# EAGLE design SparkFun_MicroMod_Function_SARA-R5 (EAGLE 9.6.2)
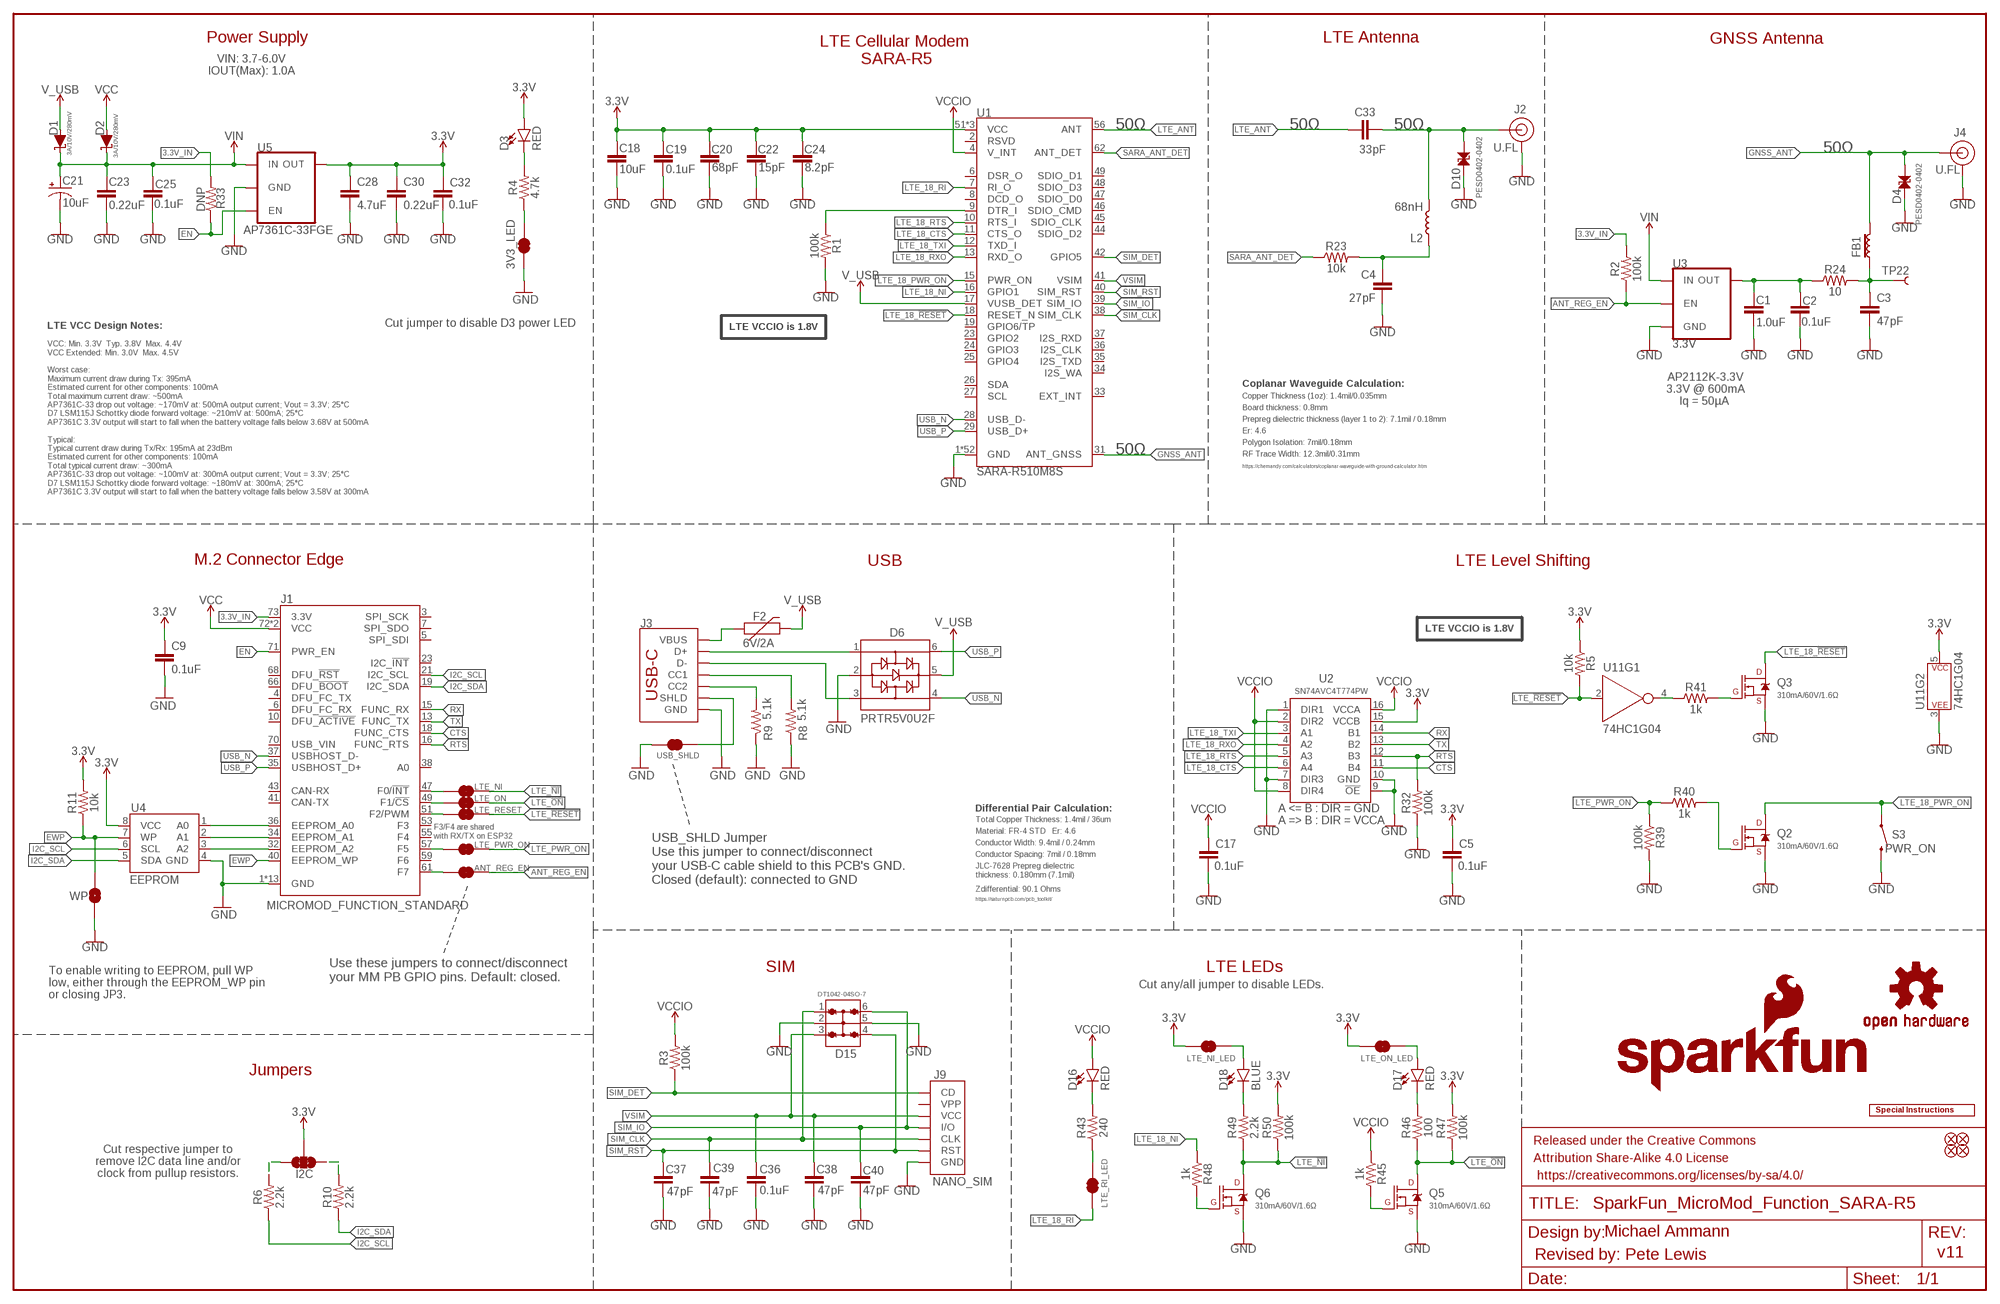
[diagram p0: schematic, sheet 1]

## Parts
3V3_LED  JUMPER-SMT_2_NC_TRACE_SILK  [SMT-JUMPER_2_NC_TRACE_SILK]
ANT_REG_EN  JUMPER-SMT_2_NC_TRACE_SILK  [SMT-JUMPER_2_NC_TRACE_SILK]
C1  1.0uF  1.0UF-0603-16V-10%  [0603]
C2  0.1uF  0.1UF-0402T-16V-10%  [0402-TIGHT]
C3  47pF  47PF-0603-50V-5%  [0603]
C4  27pF  27PF-0402-50V-5%  [0402]
C5  0.1uF  0.1UF-0402T-16V-10%  [0402-TIGHT]
C9  0.1uF  0.1UF-0402T-16V-10%  [0402-TIGHT]
C17  0.1uF  0.1UF-0402T-16V-10%  [0402-TIGHT]
C18  10uF  10UF-0603-6.3V-20%  [0603]
C19  0.1uF  0.1UF-0402T-16V-10%  [0402-TIGHT]
C20  68pF  68PF-0603-50V-5%  [0603]
C21  10uF  10UF-POLAR-EIA3216-16V-10%(TANT)  [EIA3216]
C22  15pF  15PF-0603-50V-5%  [0603]
C23  0.22uF  0.22UF-0603-25V-10%  [0603]
C24  8.2pF  8.2PF-0603-50V-10%  [0603]
C25  0.1uF  0.1UF-0402T-16V-10%  [0402-TIGHT]
C28  4.7uF  4.7UF-0603-6.3V-(10%)  [0603]
C30  0.22uF  0.22UF-0603-25V-10%  [0603]
C32  0.1uF  0.1UF-0402T-16V-10%  [0402-TIGHT]
C33  33pF  33PF-0402T-50V-5%  [0402-TIGHT]
C36  0.1uF  0.1UF-0402T-16V-10%  [0402-TIGHT]
C37  47pF  47PF-0603-50V-5%  [0603]
C38  47pF  47PF-0603-50V-5%  [0603]
C39  47pF  47PF-0603-50V-5%  [0603]
C40  47pF  47PF-0603-50V-5%  [0603]
D1  3A/10V/280mV  DIODE-SCHOTTKY-BAT60A  [SOD-323]
D2  3A/10V/280mV  DIODE-SCHOTTKY-BAT60A  [SOD-323]
D3  RED  LED-RED_0603-KB  [LED-0603]
D4  PESD0402-0402  [0402]
D6  PRTR5V0U2F  [SOT886]
D10  PESD0402-0402  [0402]
D15  DT1042-04SO-7  TVS_DIODE_ARRAY_4_ESDA6V1BC6  [SOT23-6L]
D16  RED  LED-RED_0603-KB  [LED-0603]
D17  RED  LED-RED_0603-KB  [LED-0603]
D18  BLUE  LED-BLUE0603  [LED-0603]
F2  6V/2A  PPTC_6V2A  [1210]
FB1  30Ω/1.8A  FERRITE_BEAD-0603  [0603]
FD1  FIDUCIALUFIDUCIAL  [FIDUCIAL-MICRO]
FD2  FIDUCIALUFIDUCIAL  [FIDUCIAL-MICRO]
FD3  FIDUCIALUFIDUCIAL  [FIDUCIAL-MICRO]
FD4  FIDUCIALUFIDUCIAL  [FIDUCIAL-MICRO]
FRAME2  FRAME-LEDGER  [CREATIVE_COMMONS]
I2C  JUMPER-SMT_3_2-NC_TRACE_SILK  [SMT-JUMPER_3_2-NC_TRACE_SILK]
J1  MICROMOD_FUNCTION_STANDARD  [M.2-CARD-E-22_FUNCTION_STANDARD]
J2  U.FL  U.FL2PIN  [U.FL]
J3  USB_C_2-LAYER_PADS  [USB-C-16P-2LAYER-PADS]
J4  U.FL  U.FL2PIN  [U.FL]
J9  NANO_SIM  SIMHOLDER_WITH_CD-PUSHPUSH  [NANO_SIM_PP]
L2  68nH  68NH-0402-200MA  [0402_COILCRAFT]
LOGO1  SFE_LOGO_NAME_FLAME.2_INCH  [SFE_LOGO_NAME_FLAME_.2]
LOGO2  SFE_LOGO_FLAME.2_INCH  [SFE_LOGO_FLAME_.2]
LOGO3  SPECIAL_INSTRUCTIONS-ORDERING  [ORDERING_INSTRUCTIONS]
LOGO4  OSHW-LOGOMINI  [OSHW-LOGO-MINI]
LTE_NI  JUMPER-SMT_2_NC_TRACE_SILK  [SMT-JUMPER_2_NC_TRACE_SILK]
LTE_NI_LED  JUMPER-SMT_2_NC_TRACE_SILK  [SMT-JUMPER_2_NC_TRACE_SILK]
LTE_ON  JUMPER-SMT_2_NC_TRACE_SILK  [SMT-JUMPER_2_NC_TRACE_SILK]
LTE_ON_LED  JUMPER-SMT_2_NC_TRACE_SILK  [SMT-JUMPER_2_NC_TRACE_SILK]
LTE_PWR_ON  JUMPER-SMT_2_NC_TRACE_SILK  [SMT-JUMPER_2_NC_TRACE_SILK]
LTE_RESET  JUMPER-SMT_2_NC_TRACE_SILK  [SMT-JUMPER_2_NC_TRACE_SILK]
LTE_RI_LED  JUMPER-SMT_2_NC_TRACE_SILK  [SMT-JUMPER_2_NC_TRACE_SILK]
Q2  310mA/60V/1.6Ω  MOSFET-NCH-2N7002PW  [SOT323]
Q3  310mA/60V/1.6Ω  MOSFET-NCH-2N7002PW  [SOT323]
Q5  310mA/60V/1.6Ω  MOSFET-NCH-2N7002PW  [SOT323]
Q6  310mA/60V/1.6Ω  MOSFET-NCH-2N7002PW  [SOT323]
R1  100k  100KOHM-0402T-1/16W-1%  [0402-TIGHT]
R2  100k  100KOHM-0402T-1/16W-1%  [0402-TIGHT]
R3  100k  100KOHM-0402T-1/16W-1%  [0402-TIGHT]
R4  4.7k  4.7KOHM-0402T-1/16W-1%  [0402-TIGHT]
R5  10k  10KOHM-0402T-1/16W-1%  [0402-TIGHT]
R6  2.2k  2.2KOHM-0402T-1/16W-1%  [0402-TIGHT]
R8  5.1k  5.1KOHM-0402T-1/16W-1%  [0402-TIGHT]
R9  5.1k  5.1KOHM-0402T-1/16W-1%  [0402-TIGHT]
R10  2.2k  2.2KOHM-0402T-1/16W-1%  [0402-TIGHT]
R11  10k  10KOHM-0402T-1/16W-1%  [0402-TIGHT]
R23  10k  10KOHM-0402T-1/16W-1%  [0402-TIGHT]
R24  10  10OHM-0603-1/10W-1%  [0603]
R32  100k  100KOHM-0402T-1/16W-1%  [0402-TIGHT]
R33  DNP  100KOHM-0402T-1/16W-1%  [0402-TIGHT]
R39  100k  100KOHM-0402T-1/16W-1%  [0402-TIGHT]
R40  1k  1KOHM-0402T-1/16W-1%  [0402-TIGHT]
R41  1k  1KOHM-0402T-1/16W-1%  [0402-TIGHT]
R43  240  240OHM-0603-1/10W-1%  [0603]
R45  1k  1KOHM-0402T-1/16W-1%  [0402-TIGHT]
R46  100  100OHM-0603-1/10W-1%  [0603]
R47  100k  100KOHM-0402T-1/16W-1%  [0402-TIGHT]
R48  1k  1KOHM-0402T-1/16W-1%  [0402-TIGHT]
R49  2.2k  2.2KOHM-0402T-1/16W-1%  [0402-TIGHT]
R50  100k  100KOHM-0402T-1/16W-1%  [0402-TIGHT]
S3  PWR_ON  MOMENTARY-SWITCH-SPST-SMD-4.6X2.8MM  [TACTILE_SWITCH_SMD_4.6X2.8MM]
TP22  TEST-POINT3X4  [PAD.03X.04]
U1  SARA-R510M8S  [SARA-LGA]
U2  SN74AVC4T774PW  [SOP65P640X120-16N]
U3  3.3V  V_REG_AP2112K-3.3V  [SOT23-5]
U4  EEPROM  EEPROM-I2C512K  [SO08]
U5  AP7361C-33FGE  AP7361C-33FGEUDFN-8  [UDFN-8]
U11  74HC1G04  [SOT353]
USB_SHLD  JUMPER-SMT_2_NC_TRACE_SILK  [SMT-JUMPER_2_NC_TRACE_SILK]
WP  JUMPER-SMT_2_NO_SILK  [SMT-JUMPER_2_NO_SILK]

## Nets
3.3V: C5.1 C9.1 C18.1 C19.1 C20.1 C22.1 C24.1 C28.1 C30.1 C32.1 D3.A I2C.2 LTE_NI_LED.2 LTE_ON_LED.2 R5.1 R11.2 R47.2 R50.2 U1.51(VCC) U1.52(VCC) U1.53(VCC) U2.15(VCCB) U4.8(VCC) U5.1(OUT) U11.5(P$V+)
3.3V_IN: J1.73(3.3V) R2.2 R33.2
ANT_REG_EN: ANT_REG_EN.1 R2.1 U3.3(EN)
CTS: J1.18(FUNC_CTS) U2.11(B4)
EN: J1.71(PWR_EN) R33.1 U5.5(EN)
EWP: J1.40(EEPROM_WP) R11.1 U4.7(WP) WP.2
GND: 3V3_LED.1 C1.2 C2.2 C3.2 C4.2 C5.2 C9.2 C17.2 C18.2 C19.2 C20.2 C21.- C22.2 C23.2 C24.2 C25.2 C28.2 C30.2 C32.2 C36.1 C37.2 C38.1 C39.2 C40.1 D4.2 D6.2 D10.2 D15.2 D15.5 J1.1(GND) J1.2(GND) J1.8(GND) J1.33(GND) J1.39(GND) J1.45(GND) J1.75(GND) J1.GND1(GND) J1.GND2(GND) J1.GND3(GND) J1.GND4(GND) J1.GND5(GND) J1.GND6(GND) J2.1(GND) J2.2(GND) J3.GND J3.GND2(GND) J4.1(GND) J4.2(GND) J9.A1(GND) J9.A2(GND) J9.A3(GND) J9.A4(GND) J9.C5(GND) Q2.2(S) Q3.2(S) Q5.2(S) Q6.2(S) R1.2 R8.1 R9.1 R32.1 R39.2 S3.3 S3.4 U1.1(GND) U1.3(GND) U1.5(GND) U1.14(GND) U1.20(GND) U1.21(GND) U1.22(GND) U1.30(GND) U1.32(GND) U1.43(GND) U1.50(GND) U1.54(GND) U1.55(GND) U1.57(GND) U1.58(GND) U1.59(GND) U1.60(GND) U1.61(GND) U1.63(GND) U1.64(GND) U1.65(GND) U1.66(GND) U1.67(GND) U1.68(GND) U1.69(GND) U1.70(GND) U1.71(GND) U1.72(GND) U1.73(GND) U1.74(GND) U1.75(GND) U1.76(GND) U1.77(GND) U1.78(GND) U1.79(GND) U1.80(GND) U1.81(GND) U1.82(GND) U1.83(GND) U1.84(GND) U1.85(GND) U1.86(GND) U1.87(GND) U1.88(GND) U1.89(GND) U1.90(GND) U1.91(GND) U1.92(GND) U1.93(GND) U1.94(GND) U1.95(GND) U1.96(GND) U2.1(DIR1) U2.7(DIR3) U2.9(!OE) U2.10(GND) U3.2(GND) U4.4(GND) U5.4(GND) U5.EP(GND) U11.3(P$V-) USB_SHLD.2 WP.1
GNSS_ANT [RF]: D4.1 FB1.2 J4.FEED(SIGNAL) U1.31(ANT_GNSS)
I2C_SCL: J1.21(I2C_SCL) R6.1 U4.6(SCL)
I2C_SDA: J1.19(I2C_SDA) R10.1 U4.5(SDA)
LTE_18_!RESET!: Q3.3(D) U1.18(RESET_N)
LTE_18_CTS: U1.11(CTS_O) U2.6(A4)
LTE_18_DTR: R1.1 U1.9(DTR_I)
LTE_18_NI: R48.1 U1.16(GPIO1)
LTE_18_PWR_ON: Q2.3(D) S3.1 S3.2 U1.15(PWR_ON)
LTE_18_RI: LTE_RI_LED.2 U1.7(RI_O)
LTE_18_RTS: U1.10(RTS_I) U2.5(A3)
LTE_18_RXO: U1.13(RXD_O) U2.4(A2)
LTE_18_TXI: U1.12(TXD_I) U2.3(A1)
LTE_!NI!: LTE_NI.1 Q6.3(D) R49.1 R50.1
LTE_!ON!: LTE_ON.1 Q5.3(D) R46.1 R47.1
LTE_!RESET!: LTE_RESET.1 R5.2 U11.2(A)
LTE_ANT [RF]: C33.1 U1.56(ANT)
LTE_PWR_ON: LTE_PWR_ON.1 R39.1 R40.1
N$1: J1.36(EEPROM_A0) U4.1(A0)
N$2: J3.A5(CC1) R8.2
N$3: J1.57(F5) LTE_PWR_ON.2
N$4: ANT_REG_EN.2 J1.61(F7)
N$5: J3.B5(CC2) R9.2
N$6: 3V3_LED.2 R4.1
N$7: D3.C R4.2
N$8: J1.32(EEPROM_A2) U4.3(A2)
N$9: J1.34(EEPROM_A1) U4.2(A1)
N$10: D6.1 J3.A6(D+) J3.B6(D+)
N$11 [RF]: C33.2 D10.1 J2.FEED(SIGNAL) L2.P$2
N$12: J1.47(F0/!INT!) LTE_NI.2
N$13: I2C.1 R10.2
N$14: I2C.3 R6.2
N$15 [DiffPair]: D6.3 J3.A7(D-) J3.B7(D-)
N$16: J1.49(F1/!CS!) LTE_ON.2
N$17: J1.51(F2/PWM) LTE_RESET.2
N$18: C4.1 L2.P$1 R23.2
N$19: D18.A LTE_NI_LED.1
N$20: LTE_RI_LED.1 R43.1
N$21: D17.A LTE_ON_LED.1
N$22: F2.1 J3.VBUS1(VBUS) J3.VBUS2(VBUS)
N$24: C1.1 C2.1 R24.1 U3.5(OUT)
N$25: C3.1 FB1.1 R24.2 TP22.1
N$26: Q2.1(G) R40.2
N$27: Q3.1(G) R41.2
N$28: R41.1 U11.4(Y)
N$34: D16.C R43.2
N$35: Q6.1(G) R48.2
N$37: D18.C R49.2
N$47: Q5.1(G) R45.2
N$49: D17.C R46.2
RTS: J1.16(FUNC_RTS) R32.2 U2.12(B3)
RX: J1.15(FUNC_RX) U2.14(B1)
SARA_ANT_DET: R23.1 U1.62(ANT_DET)
SHLD: J3.SHLD1(SHLD) J3.SHLD2(SHLD) J3.SHLD3(SHLD) J3.SHLD4(SHLD) USB_SHLD.1
SIM_CLK: C39.1 D15.1 J9.C3(CLK) U1.38(SIM_CLK)
SIM_DET: J9.CD R3.1 U1.42(GPIO5)
SIM_IO: C40.2 D15.6 J9.C7(I/O) U1.39(SIM_IO)
SIM_RST: C37.1 D15.4 J9.C2(RST) U1.40(SIM_RST)
TX: J1.13(FUNC_TX) U2.13(B2)
USB_N [DiffPair]: D6.4 J1.37(USBHOST_D-) U1.28(USB_D-)
USB_P [DiffPair]: D6.6 J1.35(USBHOST_D+) U1.29(USB_D+)
V_USB: D1.A D6.5 F2.2 U1.17(VUSB_DET)
VCC: D2.A J1.72(VCC) J1.74(VCC)
VCCIO [supply]: C17.1 D16.A R3.2 R45.1 U1.4(V_INT) U2.2(DIR2) U2.8(DIR4) U2.16(VCCA)
VIN: C21.+ C23.1 C25.1 D1.C D2.C U3.1(IN) U5.8(IN)
VSIM [supply]: C36.2 C38.2 D15.3 J9.C1(VCC) U1.41(VSIM)
Unconnected: J1.3(SPI_SCK) J1.4(DFU_FC_TX) J1.5(SPI_SDI) J1.6(DFU_FC_RX) J1.7(SPI_SDO) J1.10(DFU_!ACTIVE!) J1.23(I2C_!INT!) J1.38(A0) J1.41(CAN-TX) J1.43(CAN-RX) J1.53(F3) J1.55(F4) J1.59(F6) J1.66(DFU_!BOOT!) J1.68(DFU_!RST!) J1.70(USB_VIN) J9.C6(VPP) U1.2(RSVD) U1.6(DSR_O) U1.8(DCD_O) U1.19(GPIO6/TP) U1.23(GPIO2) U1.24(GPIO3) U1.25(GPIO4) U1.26(SDA) U1.27(SCL) U1.33(EXT_INT) U1.34(I2S_WA) U1.35(I2S_TXD) U1.36(I2S_CLK) U1.37(I2S_RXD) U1.44(SDIO_D2) U1.45(SDIO_CLK) U1.46(SDIO_CMD) U1.47(SDIO_D0) U1.48(SDIO_D3) U1.49(SDIO_D1)

## Notes on the sheet
- Power Supply | LTE Antenna | GNSS Antenna
- LTE Cellular Modem 
  SARA-R5
- VIN: 3.7-6.0V
  IOUT(Max): 1.0A
- 50Ω | 50Ω | 50Ω
- 50Ω
- LTE VCCIO is 1.8V
- LTE VCC Design Notes: | Cut jumper to disable D3 power LED
- VCC: Min. 3.3V  Typ. 3.8V  Max. 4.4V
  VCC Extended: Min. 3.0V  Max. 4.5V
  
  Worst case:
  Maximum current draw during Tx: 395mA
  Estimated current for other components: 100mA
  Total maximum current draw: ~500mA
  AP7361C-33 drop out voltage: ~170mV at: 500mA output current; Vout = 3.3V; 25°C
  D7 LSM115J Schottky diode forward voltage: ~210mV at: 500mA; 25°C
  AP7361C 3.3V output will start to fall when the battery voltage falls below 3.68V at 500mA
  
  Typical:
  Typical current draw during Tx/Rx: 195mA at 23dBm
  Estimated current for other components: 100mA
  Total typical current draw: ~300mA
  AP7361C-33 drop out voltage: ~100mV at: 300mA output current; Vout = 3.3V; 25°C
  D7 LSM115J Schottky diode forward voltage: ~180mV at: 300mA; 25°C
  AP7361C 3.3V output will start to fall when the battery voltage falls below 3.58V at 300mA
- Coplanar Waveguide Calculation:
- AP2112K-3.3V
  3.3V @ 600mA
  Iq = 50µA
- Copper Thickness (1oz): 1.4mil/0.035mm
- Board thickness: 0.8mm
- Prepreg dielectric thickness (layer 1 to 2): 7.1mil / 0.18mm
- Er: 4.6
- Polygon Isolation: 7mil/0.18mm
- 50Ω | RF Trace Width: 12.3mil/0.31mm
- https://chemandy.com/calculators/coplanar-waveguide-with-ground-calculator.htm
- M.2 Connector Edge | USB | LTE Level Shifting
- LTE VCCIO is 1.8V
- Differential Pair Calculation:
- Total Copper Thickness: 1.4mil / 36um
- Material: FR-4 STD   Er: 4.6
- F3/F4 are shared 
  with RX/TX on ESP32
- Conductor Width: 9.4mil / 0.24mm
- Conductor Spacing: 7mil / 0.18mm
- JLC-7628 Prepreg dielectric 
  thickness: 0.180mm (7.1mil)
- USB_SHLD Jumper
  Use this jumper to connect/disconnect
  your USB-C cable shield to this PCB's GND.
  Closed (default): connected to GND
- Zdifferential: 90.1 Ohms
- https://saturnpcb.com/pcb_toolkit/
- SIM | LTE LEDs
- Use these jumpers to connect/disconnect
  your MM PB GPIO pins. Default: closed.
- Cut any/all jumper to disable LEDs.
- To enable writing to EEPROM, pull WP
  low, either through the EEPROM_WP pin
  or closing JP3.
- Jumpers
- Cut respective jumper to
  remove I2C data line and/or
  clock from pullup resistors.
- Michael Ammann
- Revised by: Pete Lewis | v11

## Library data of the parts
3V3_LED ANT_REG_EN LTE_NI LTE_NI_LED LTE_ON LTE_ON_LED LTE_PWR_ON LTE_RESET LTE_RI_LED USB_SHLD = SparkFun-Jumpers:JUMPER-SMT_2_NC_TRACE: Normally closed trace jumper This jumper has a trace between two pads so it's normally closed (NC). Use a razor knife to open the connection. For best results follow the IPC guidelines for cutting traces: Cutout at least 0.063 mm (0.005 in). Remove all loose material to clean up the cut area. Seal the cut with an approved epoxy. Reapply solder to reclose the connection.
C1 = SparkFun-Capacitors:1.0UF: 1µF ceramic capacitors A capacitor is a passive two-terminal electrical component used to store electrical energy temporarily in an electric field.; PROD_ID: CAP-00868
C2 C5 C9 C17 C19 C25 C32 C36 = SparkFun-Capacitors:0.1UF: 0.1µF ceramic capacitors A capacitor is a passive two-terminal electrical component used to store electrical energy temporarily in an electric field.; PROD_ID: CAP-12416
C3 C37-C40 = SparkFun-Capacitors:47PF: 47pF ceramic capacitors A capacitor is a passive two-terminal electrical component used to store electrical energy temporarily in an electric field.; PROD_ID: CAP-08913
C4 = SparkFun-Capacitors:27PF: 27pF ceramic capacitors A capacitor is a passive two-terminal electrical component used to store electrical energy temporarily in an electric field.; PROD_ID: CAP-15357
C18 = SparkFun-Capacitors:10UF: 10.0µF ceramic capacitors A capacitor is a passive two-terminal electrical component used to store electrical energy temporarily in an electric field.; PROD_ID: CAP-11015
C20 = SparkFun-Capacitors:68PF: 68pF ceramic capacitors A capacitor is a passive two-terminal electrical component used to store electrical energy temporarily in an electric field.; PROD_ID: CAP-14092
C21 = SparkFun-Capacitors:10UF-POLAR: 10.0µF polarized capacitors A capacitor is a passive two-terminal electrical component used to store electrical energy temporarily in an electric field.; PROD_ID: CAP-00811
C22 = SparkFun-Capacitors:15PF: 15pF ceramic capacitors A capacitor is a passive two-terminal electrical component used to store electrical energy temporarily in an electric field.; PROD_ID: CAP-07881
C23 C30 = SparkFun-Capacitors:0.22UF: 0.22µF ceramic capacitors A capacitor is a passive two-terminal electrical component used to store electrical energy temporarily in an electric field.; PROD_ID: CAP-07822
C24 = SparkFun-Capacitors:8.2PF: 8.2pF ceramic capacitors A capacitor is a passive two-terminal electrical component used to store electrical energy temporarily in an electric field.; PROD_ID: CAP-16662
C28 = SparkFun-Capacitors:4.7UF: 4.7µF ceramic capacitors A capacitor is a passive two-terminal electrical component used to store electrical energy temporarily in an electric field.; PROD_ID: CAP-08280
C33 = SparkFun-Capacitors:33PF: 33pF ceramic capacitors A capacitor is a passive two-terminal electrical component used to store electrical energy temporarily in an electric field.; PROD_ID: CAP-15358
D1 D2 = SparkFun-DiscreteSemi:DIODE-SCHOTTKY: Schottky diode A Schottky diode is a semiconductor diode which has a low forward voltage drop and a very fast switching action.; PROD_ID: DIO-14072
D3 D16 D17 = SparkFun-LED:LED-RED: Red SMD LED Used in manufacturing of most products at SparkFun Packages: 0603 - KB - KingBright (DIO-17976) SMD 0603 package [Datasheet] <https://www.kingbrightusa.com/images/catalog/SPEC/APT1608SURCK.pdf> 0603 - (DIO-00819, has gone EOL) SMD 0603 package 0603 SMART - SMD 0603 SMART package ( more efficient and expensive)[Product Link] <http://www.osram-os.com/Graphics/XPic2/00077099_0.pdf> 1206 - SMD1206 package [Product Link] <https://www.sparkfun.com/datasheets/DevTools/LilyPad/Q150OVS4.pdff> SparkFun Products: Pro Mini 328 -5V <https://www.sparkfun.com/products/821> RedBoard <https://www.sparkfun.com/products/12757> IOIO-OTG <https://www.sparkfun.com/products/13613>; PROD_ID: DIO-17976
D4 D10 = SparkFun-DiscreteSemi:PESD0402: ESD protection diode PESD is used to protect a signal line from ESD.; DIGIKEY_PART: PESD0402-140CT-ND; MOUSE_PART: 650-PESD0402-140; PROD_ID: DIO-15359
D6 = SparkFun-IC-Power:PRTR5V0U2: A small ESD protection device. Most commonly used on USB D+/D- signals to protect large, expensive, or especially sensitive USB enabled devices.; PROD_ID: DIO-14084
D15 = SparkFun-DiscreteSemi:TVS_DIODE_ARRAY_4; PROD_ID: DIO-14095
D18 = SparkFun-LED:LED-BLUE: Blue SMD LED Used in manufacturing of various products at SparkFun Packages: 0603 - SMD 0603 package [Product Link] <http://www.digikey.com/product-detail/en/SMLE12BC7TT86/511-1589-2-ND/1641808> 1206 - SMD1206 package [Product Link] <http://www.digikey.com/product-detail/en/lite-on-inc/LTST-C150TBKT/160-1643-1-ND/573584> SparkFun Products: ESP8266 Thing-Dev Board <https://www.sparkfun.com/products/13711> RedBoard <https://www.sparkfun.com/products/12757>; PROD_ID: DIO-08575
F2 = SparkFun-Fuses:PPTC: Resettable Fuse PPTC Resettable Fuse. Really a sort of resistor with a polymeric positive temperature coefficient whose resistance increases dramatically with an increase in temperature. When heated by the power passing through the resistance rises causing the current to be limited, protecting the circuit. This is achieved by the transition of the polymer from a crystalline to an amorphous state where the conductive carbon separates breaking the conductive pathways found in the cool crystalline structure. When a PPTC cools back down it resumes conducting letting the circuit turn back on. SparkFun Products: SparkFun RedBoard - Programmed with Arduino <https://www.sparkfun.com/products/12757> Pro Micro - 5V/16MHz <https://www.sparkfun.com/products/12640> Arduino Pro 328 - 5V/16MHz <https://www.sparkfun.com/products/10915> MP3 Trigger <https://www.sparkfun.com/products/13720>; PROD_ID: RES-14313
FB1 = SparkFun-Coils:FERRITE_BEAD: Ferrite Bead (blocks, cores, rings, chokes, etc.) Inductor with layers of ferrite used to suppress high frequencies. Often used to isolate high frequency noise. SparkFun Products: IOIO-OTG - V2.2 <https://www.sparkfun.com/products/13613> SparkFun SAMD21 Mini Breakout <https://www.sparkfun.com/products/13664> SparkFun 6 Degrees of Freedom Breakout - LSM6DS3 <https://www.sparkfun.com/products/13339> SparkFun SAMD21 Dev Breakout <https://www.sparkfun.com/products/13672> Lilypad MP3 <https://www.sparkfun.com/products/11013>; PROD_ID: NDUC-13805
FD1-FD4 = SparkFun-Aesthetics:FIDUCIAL: Fiducial Alignment Points Point-of-reference for pick-and-place machines and other optical instruments.
FRAME2 = SparkFun-Aesthetics:FRAME-LEDGER: Schematic Frame - Ledger Standard 11x14 US Ledger frame
I2C = SparkFun-Jumpers:JUMPER-SMT_3_2-NC_TRACE: Normally closed trace jumper (2 of 2 connections) This jumper has a trace between all three pads so they are normally closed (NC). Use a razor knife to open the connection(s). For best results follow the IPC guidelines for cutting traces: Cutout at least 0.063 mm (0.005 in). Remove all loose material to clean up the cut area. Seal the cut with an approved epoxy. Reapply solder to reclose the connection(s).
J1 = SparkFun-MicroMod:MICROMOD_FUNCTION: MicroMod Connector Description: A card edge connector and mating PCB connector to allow various MicroMod Processor Boards to be coupled with various carrier boards of different capabilities. Based on the M.2 standard.
J2 J4 = SparkFun-Connectors:U.FL2PIN: SMD Antenna Connector - U.FL 2mm height, 3.0mm x 3.0mm receptacle size. SparkFun Products: SparkFun WiFi Shield - ESP8266 <https://www.sparkfun.com/products/13287> SparkFun ESP8266 Thing <https://www.sparkfun.com/products/13231> SparkFun MiniGen - Pro Mini Signal Generator Shield <https://www.sparkfun.com/products/11420>; PROD_ID: CONN-09193; SF_ID: WRL-09144
J3 = SparkFun-Connectors:USB_C: USB Type C 16Pin Connector Super Speed pins not available on the 16-pin purely SMD connector so this part is best for USB 2.0 implementations. D1 and D2 are tied together enabling D+/- no matter which way the cable is plugged into the connector. The two channel configuration pins (CC1/2) are exposed. These are normally connected to ground via 5.1k resistors but can be reconfigured for high current/high power applications. **4-LAYER BOARD WARNING!!** If designing 4-layer board, make sure to select the variant _4-LAYER-ISOLATED. The linked footprint (USB-C-16-4LAYER-ISOLATED) includes some very necessary cutout polygons in the inner layers (2 and 15). This prevents the PTH mounting shield legs on the USB connector from electrically connecting any other polygons on the inner layers (usually VCC and GND).; PROD_ID: CONN-14122
J9 = SparkFun-Connectors:SIMHOLDER_WITH_CD: SIM Cellular Card Socket SMT 6 pin standard connection. SparkFun Products: SIM Socket <https://www.sparkfun.com/products/548> SparkFun Cellular Shield - MG2639 <https://www.sparkfun.com/products/13120> SparkFun SIM Card Socket Breakout <https://www.sparkfun.com/products/573>; PROD_ID: CONN-16272
L2 = SparkFun-Coils:68NH; PROD_ID: NDUC-15356
LOGO1 = SparkFun-Aesthetics:SFE_LOGO_NAME_FLAME: SparkFun Font Logo w/ Flame This is the SparkFun full logo. The logo on the schematic will always be the same size; the package variant is the height of the flame part of the logo. Default layer for the logo on the board is tSilk.
LOGO2 = SparkFun-Aesthetics:SFE_LOGO_FLAME: SparkFun Flame Logo This is the SparkFun flame logo. The logo on the schematic will always be the same size; the package variant is the height of the flame. Default layer for the logo on the board is tSilk.
LOGO3 = SparkFun-Aesthetics:SPECIAL_INSTRUCTIONS: Special Ordering/Production Instructions Alert Symbol for special PCB ordering instructions or unique production process warnings. Ordering Instructions Production Instructions Types of information that should be added to box: Copper weight Soldermask color Silk color PCB thickness Number of layers PCB Standard: 1.6mm FR4 1 oz copper immersion silver plating red soldermask white silkscreen Types of information that should be added to box: Special wash requirements Depaneling instructions Humidification Glue curing Default text settings: 0.07 inch 9% ratio 50% line distance
LOGO4 = SparkFun-Aesthetics:OSHW-LOGO: Open-Source Hardware (OSHW) Logo This logo indicates the piece of hardware it is found on incorporates a OSHW license and/or adheres to the definition of open source hardware found here: http://freedomdefined.org/OSHW
Q2 Q3 Q5 Q6 = SparkFun-DiscreteSemi:MOSFET-NCH: N-channel MOSFETs Voltage controlled devices that allow control of high current outputs. SparkFun Products: SparkFun OpenScale <https://www.sparkfun.com/products/13261> SparkFun Digital Sandbox <https://www.sparkfun.com/products/12651> SparkFun Monster Moto Shield <https://www.sparkfun.com/products/10182> SparkFun MOSFET Power Controller <https://www.sparkfun.com/products/11214>; PROD_ID: TRANS-11151
R1-R3 R32 R39 R47 R50 = SparkFun-Resistors:100KOHM: 100kΩ resistor A resistor is a passive two-terminal electrical component that implements electrical resistance as a circuit element. Resistors act to reduce current flow, and, at the same time, act to lower voltage levels within circuits. - Wikipedia; PROD_ID: RES-13495
R4 = SparkFun-Resistors:4.7KOHM: 4.7kΩ resistor A resistor is a passive two-terminal electrical component that implements electrical resistance as a circuit element. Resistors act to reduce current flow, and, at the same time, act to lower voltage levels within circuits. - Wikipedia; PROD_ID: RES-15343
R5 R11 R23 = SparkFun-Resistors:10KOHM: 10kΩ resistor A resistor is a passive two-terminal electrical component that implements electrical resistance as a circuit element. Resistors act to reduce current flow, and, at the same time, act to lower voltage levels within circuits. - Wikipedia; PROD_ID: RES-14241
R6 R10 R49 = SparkFun-Resistors:2.2KOHM: 2.2kΩ resistor A resistor is a passive two-terminal electrical component that implements electrical resistance as a circuit element. Resistors act to reduce current flow, and, at the same time, act to lower voltage levels within circuits. - Wikipedia; PROD_ID: RES-14341
R8 R9 = SparkFun-Resistors:5.1KOHM; PROD_ID: RES-14340
R24 = SparkFun-Resistors:10OHM: 10Ω resistor A resistor is a passive two-terminal electrical component that implements electrical resistance as a circuit element. Resistors act to reduce current flow, and, at the same time, act to lower voltage levels within circuits. - Wikipedia; PROD_ID: RES-12581
R33 = SparkFun-Resistors:100KOHM: 100kΩ resistor A resistor is a passive two-terminal electrical component that implements electrical resistance as a circuit element. Resistors act to reduce current flow, and, at the same time, act to lower voltage levels within circuits. - Wikipedia; PROD_ID: RES-13495; VALUE: 100k
R40 R41 R45 R48 = SparkFun-Resistors:1KOHM: 1kΩ resistor A resistor is a passive two-terminal electrical component that implements electrical resistance as a circuit element. Resistors act to reduce current flow, and, at the same time, act to lower voltage levels within circuits. - Wikipedia; PROD_ID: RES-14342
R43 = SparkFun-Resistors:240OHM: 240Ω resistor A resistor is a passive two-terminal electrical component that implements electrical resistance as a circuit element. Resistors act to reduce current flow, and, at the same time, act to lower voltage levels within circuits. - Wikipedia; PROD_ID: RES-07849
R46 = SparkFun-Resistors:100OHM: 100Ω resistor A resistor is a passive two-terminal electrical component that implements electrical resistance as a circuit element. Resistors act to reduce current flow, and, at the same time, act to lower voltage levels within circuits. - Wikipedia; PROD_ID: RES-07863
S3 = SparkFun-Switches:MOMENTARY-SWITCH-SPST: Momentary Switch (Pushbutton) - SPST Normally-open (NO) SPST momentary switches (buttons, pushbuttons). Variants PTH-12MM - 12mm square, through-hole Momentary Pushbutton Switch - 12mm Square <https://www.sparkfun.com/products/9190> (COM-09190) PTH-6.0MM, PTH-6.0MM-KIT - 6.0mm square, through-hole Mini Pushbutton Switch <https://www.sparkfun.com/products/97> (COM-00097) KIT package intended for soldering kit's - only one side of pads' copper is exposed. PTH-RIGHT-ANGLE-KIT - Right-angle, through-hole Right Angle Tactile Button <https://www.sparkfun.com/products/10791> - Used on SparkFun BigTime Watch Kit <https://www.sparkfun.com/products/11734> SMD-12MM - 12mm square, surface-mount Tactile Button - SMD (12mm) <https://www.sparkfun.com/products/12993> (COM-12993) Used on SparkFun PicoBoard <https://www.sparkfun.com/products/11888> SMD-4.5MM - 4.5mm Square Trackball Switch Used on SparkFun Blackberry Trackballer Breakout <https://www.sparkfun.com/products/13169> SMD-4.6MMX2.8MM - 4.60mm x 2.80mm, surface mount Used on SparkFun Pro Micro - RP2040 <https://www.sparkfun.com/products/17717> SMD-5.2MM, SMD-5.2-REDUNDANT - 5.2mm square, surface-mount Mini Pushbutton Switch - SMD <https://www.sparkfun.com/products/8720> (COM-08720) Used on Arduino Pro Mini <https://www.sparkfun.com/products/11114> REDUNDANT package connects both switch circuits together SMD-6.0X3.5MM - 6.0 x 3.5mm, surface mount Momentary Reset Switch SMD <https://www.sparkfun.com/products/8229> (COM-08229) SMD-6.2MM-TALL - 6.2mm square, surface mount Tactile Button - SMD (6mm) <https://www.sparkfun.com/products/12992> Used on SparkFun Digital Sandbox <https://www.sparkfun.com/products/12651> SMD-RIGHT-ANGLE - Right-angle, surface mount Used on SparkFun Block for Intel® Edison - Arduino <https://www.sparkfun.com/products/13036>; PROD_ID: SWCH-15606
TP22 = SparkFun-Connectors:TEST-POINT: SparkFun Test Points Bare copper test points for troubleshooting or In-Circuit-Testing. These are used by our Production team for verifying production board runs using pogo-pins on test beds. SparkFun Products: SparkFun LSM9DS1 Breakout <https://www.sparkfun.com/products/13284> SparkFun PSOC <https://www.sparkfun.com/products/13714> SparkFun Load Cell Amplifier <https://www.sparkfun.com/products/13879>
U1 = SparkFun-RF:SARA-R510M8S; PROD_ID: IC-15573
U2 = SparkFun-IC-Comms:SN74AVC4T774PW: Texas Instruments,SN74AVC4T774PW,IC, Texas Instruments SN74AVC4T774PW, Dual, Bus Transceiver, 4-Bit Non-Inverting 3-State, 1.2 3.6 V, 16-Pin TSSOP Source: Datasheet <http://www.ti.com/lit/ds/symlink/sn74avc4t774.pdf>; PROD_ID: IC-15360
U3 = SparkFun-IC-Power:V_REG_AP2112: AP2112 - 600mA CMOS LDO Regulator w/ Enable The AP2112 is CMOS process low dropout linear regulator with enable function, the regulator delivers a guaranteed 600mA (min.) continuous load current. Features Output Voltage Accuracy: ±1.5% Output Current: 600mA (Min.) Foldback Short Current Protection: 50mA Enable Function to Turn ON/OFF VOUT Low Dropout Voltage (3.3V): 250mV (Typ.) @IOUT=600mA Excellent Load Regulation: 0.2%/A (Typ.) Excellent Line Regulation: 0.02%/V (Typ.) Low Quiescent Current: 55μA (Typ.) Low Standby Current: 0.01μA (Typ.) Low Output Noise: 50μVRMS PSRR: 100Hz -65dB, 1kHz -65dB OTSD Protection Stable with 1.0μF Flexible Cap: Ceramic, Tantalum and Aluminum Electrolytic Operation Temperature Range: -40°C to 85°C ESD: MM 400V, HBM 4000V; PROD_ID: VREG-12457
U4 = SparkFun-IC-Memory:EEPROM-I2C: I2C EEPROMs, 24LC256 and others 24LC256 Series 256 kb I2C 2 Wire (32 k x 8 Bit) 2.5 V Serial EEPROM SMD - SOIC-8 Datasheet SparkFun Products SparkFun UDB5 - PIC UAV Development Board <https://www.sparkfun.com/products/11703> (GPS-11703); PROD_ID: IC-14645
U5 = SparkFun-IC-Power:AP7361C-33FGE: AP7361C 3.3V LDO Regulator; PROD_ID: VREG-14094
U11 = SparkFun-IC-Logic:74*1G04: Single Inverter IC NOT GATE INVERTER SNGL 1IN SOT353 Supply: 1.65V to 5.5V Datasheet <http://diodes.com/datasheets/74LVC1G04.pdf> SparkFun Products SparkFun Stepoko <https://www.sparkfun.com/products/13899> (ROB-13899) SparkFun CryptoShield <https://www.sparkfun.com/products/13183> (DEV-13183) SparkFun LogicBlocks Kit <https://www.sparkfun.com/products/11006> (KIT-11006) SparkFun ArduMoto <https://www.sparkfun.com/products/9815> (DEV-09815); PROD_ID: COMP-08268
WP = SparkFun-Jumpers:JUMPER-SMT_2_NO: Normally open jumper This jumper has two pads in close proximity to each other. Apply solder to close the connection. Round pads are easier to solder for beginners, but are a lot larger. SparkFun Product that uses the round pads: SparkFun EL Sequencer <https://www.sparkfun.com/products/12781>

## Net classes
1 power: width 0.406 mm
2 supply: width 0.406 mm
3 RF: width 0.312 mm, clearance 0.178 mm
4 DiffPair: width 0.24 mm, clearance 0.178 mm

## Board
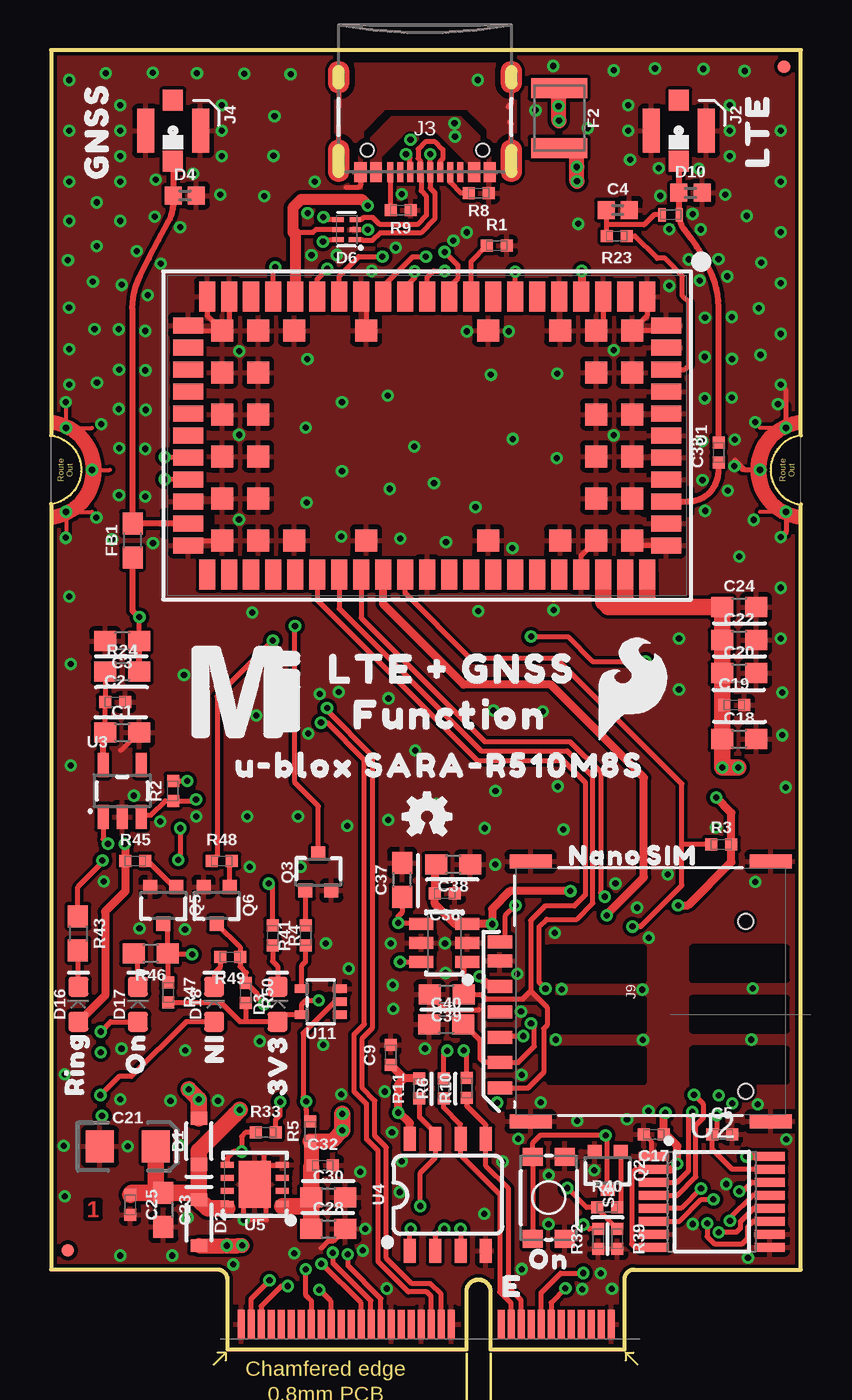
[diagram p1: board, top side]
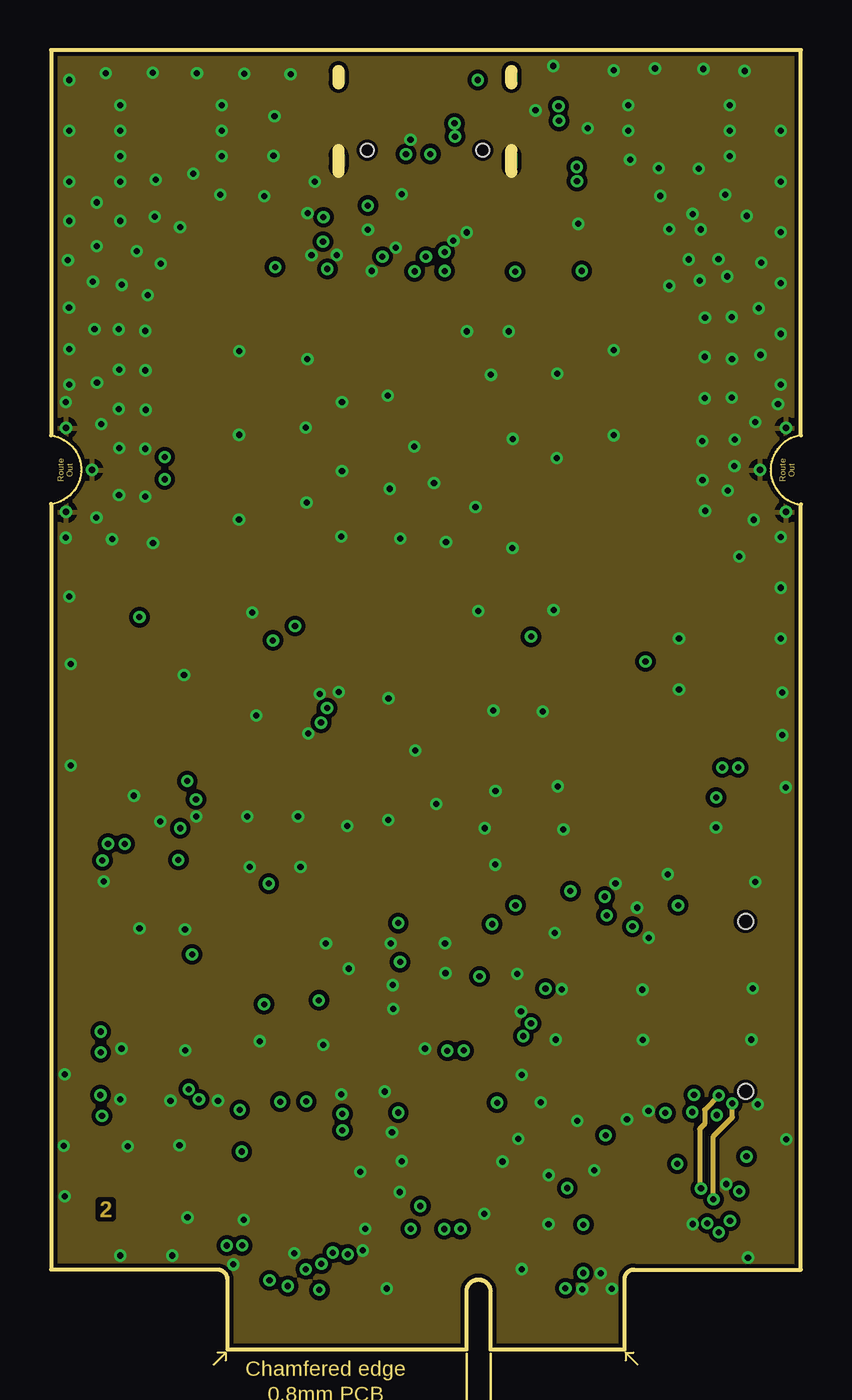
[diagram p2: board, inner layer Route2]
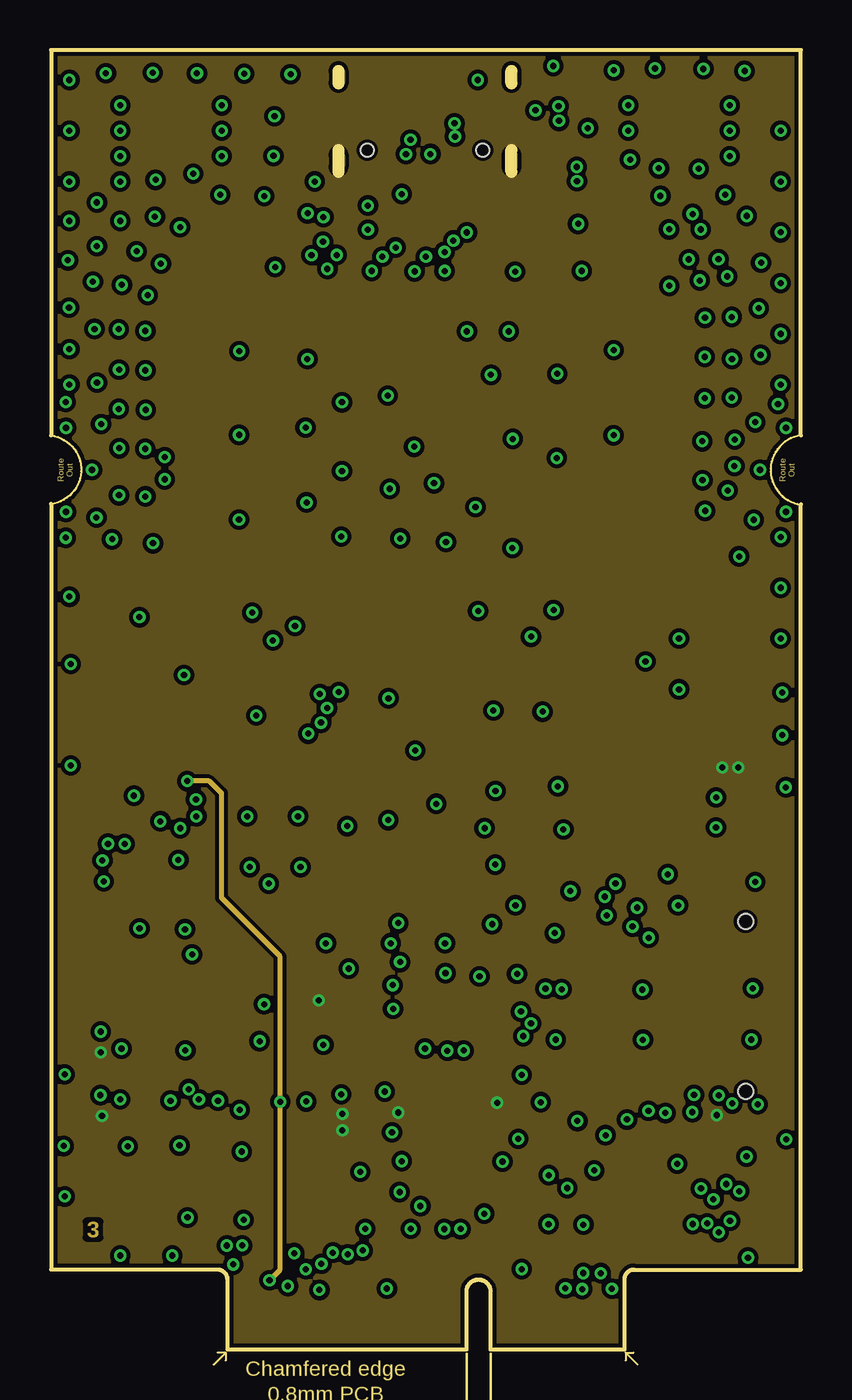
[diagram p3: board, inner layer Route15]
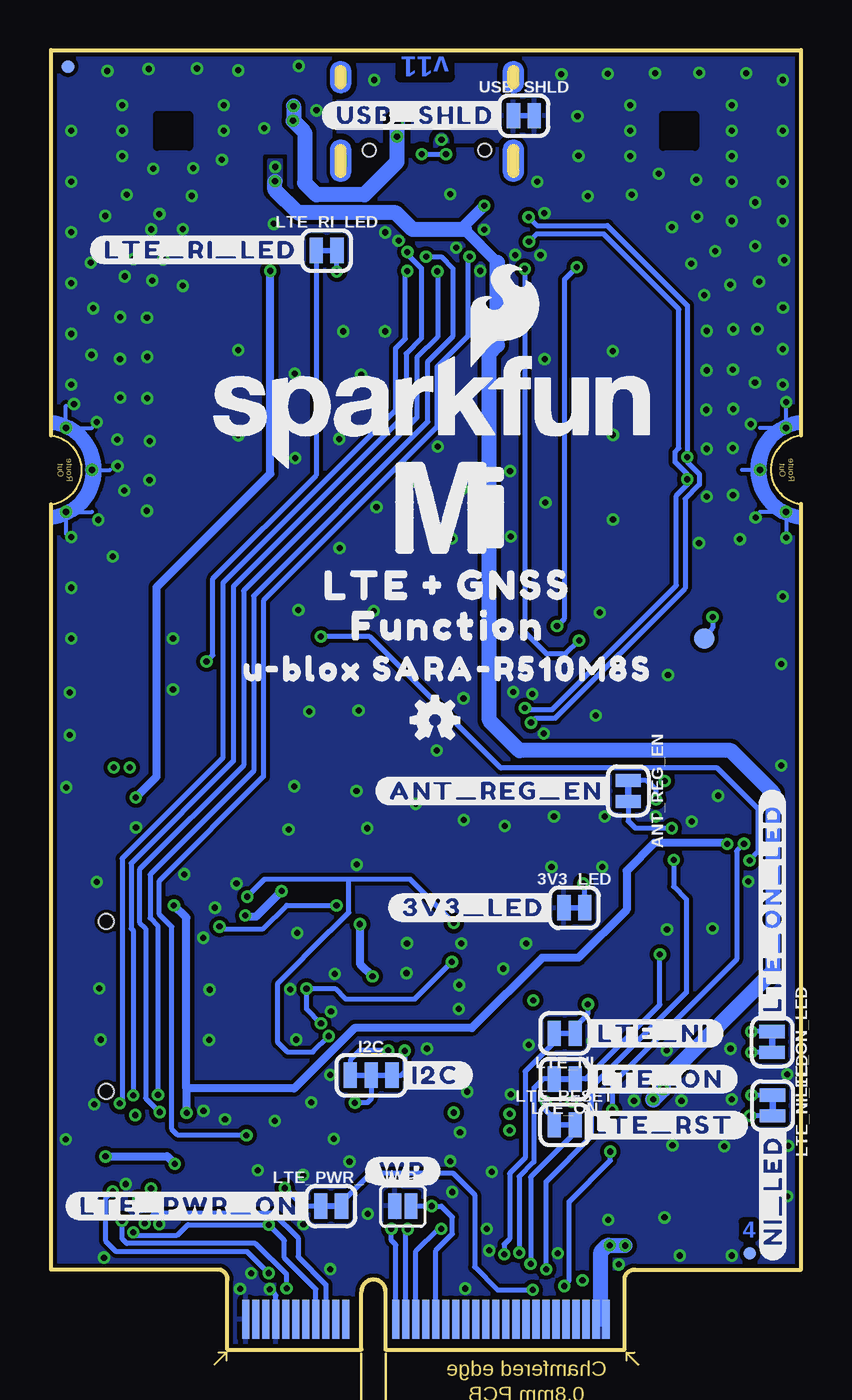
[diagram p4: board, bottom side, seen from below]

Size 37.5 x 65 mm. Coordinates in mm from the lower left corner, seen from the top.
Outline: 28.67,0 21.97,0 21.97,2.9 arc180 20.77,2.9 20.77,0 8.82,0 8.82,3.5 arc90 8.3,4 0,4 0,42.29 arc165 0,45.72 0,65 37.49,65 37.49,45.72 arc165 37.49,42.27 37.49,4 29.15,4 arc90 28.67,3.5 28.67,0
Copper layers (1+2*15+16): Top 0.035mm / dielectric 1.5mm / Route2 0.035mm / dielectric 0.15mm / Route15 0.035mm / dielectric 0.2mm / Bottom 0.035mm
Design rules "SparkFun-4-Layer-MicroMod-JLCPCB": minimum track width 4mil, minimum drill 0.2mm, track to track 4mil, track to pad 4mil, pad to pad 4mil, via to via 4mil, smd to smd 4mil, copper to edge 6mil, drill to drill 6mil, minimum pad ring 3mil, minimum via ring 3mil, stop-mask expansion 2.5mil, vias tented up to drill 25mil, thermal gap 10mil
bRestrict: area 9.1,3.6 to 9.4,3.8

### Footprints (pad centres in the part's own frame; a part is rotated, then mirrored left to right if it is on the bottom)
SMT-JUMPER_2_NC_TRACE_SILK = smd 0.66 x 1.27: 1 -0.521,0; 2 0.521,0
0603 = smd 1.1 x 1: 1 -0.85,0; 2 0.85,0
0402-TIGHT = smd 0.6 x 0.6: 1 -0.5,0; 2 0.5,0
0402 = smd 0.85 x 0.9: 1 -0.58,0; 2 0.58,0
EIA3216 = smd 1.4 x 1.6: + 1.4,0; - -1.4,0
SOD-323 = smd 0.63 x 0.83: A 1.15,0; C -1.15,0
LED-0603 = smd 1 x 1: A -0.877,0; C 0.877,0
SOT886 = smd 0.61 x 0.25: 1 -0.405,0.5 | smd 0.56 x 0.25: 2 -0.43,0; 3 -0.43,-0.5; 4 0.43,-0.5; 5 0.43,0; 6 0.43,0.5
SOT23-6L = smd 0.6 x 1.2: 1 -0.95,-1.15; 2 0,-1.15; 3 0.95,-1.15; 4 0.95,1.15; 5 0,1.15; 6 -0.95,1.15
1210 = smd 1 x 2.8: 1 -1.5,0; 2 1.5,0
FIDUCIAL-MICRO = smd 0.635 x 0.635: 1 0,0
SMT-JUMPER_3_2-NC_TRACE_SILK = smd 0.66 x 1.27: 1 -1.041,0; 2 0,0; 3 1.041,0
M.2-CARD-E-22_FUNCTION_STANDARD = smd 0.35 x 1.45: 1 9.25,1.275; 3 8.75,1.275; 5 8.25,1.275; 7 7.75,1.275; 9 7.25,1.275; 11 6.75,1.275; 13 6.25,1.275; 15 5.75,1.275; 17 5.25,1.275; 19 4.75,1.275; 21 4.25,1.275; 23 3.75,1.275; 33 1.25,1.275; 35 0.75,1.275; 37 0.25,1.275; 39 -0.25,1.275; 41 -0.75,1.275; 43 -1.25,1.275; 45 -1.75,1.275; 47 -2.25,1.275; 49 -2.75,1.275; 51 -3.25,1.275; 53 -3.75,1.275; 55 -4.25,1.275; 57 -4.75,1.275; 59 -5.25,1.275; 61 -5.75,1.275; 63 -6.25,1.275; 65 -6.75,1.275; 67 -7.25,1.275; 69 -7.75,1.275; 71 -8.25,1.275; 73 -8.75,1.275; 75 -9.25,1.275 | smd 0.35 x 1.95 bottom: 2 9,1.525; 4 8.5,1.525; 6 8,1.525; 8 7.5,1.525; 10 7,1.525; 12 6.5,1.525; 14 6,1.525; 16 5.5,1.525; 18 5,1.525; 20 4.5,1.525; 22 4,1.525; 32 1.5,1.525; 34 1,1.525; 36 0.5,1.525; 38 0,1.525; 40 -0.5,1.525; 42 -1,1.525; 44 -1.5,1.525; 46 -2,1.525; 48 -2.5,1.525; 50 -3,1.525; 52 -3.5,1.525; 54 -4,1.525; 56 -4.5,1.525; 58 -5,1.525; 60 -5.5,1.525; 62 -6,1.525; 64 -6.5,1.525; 66 -7,1.525; 68 -7.5,1.525; 70 -8,1.525; 72 -8.5,1.525; 74 -9,1.525 | drill 0.305 pad 0.61: GND1 -18,41.9; GND2 -16.7,44; GND3 -18,46.1; GND4 18,41.9; GND5 16.7,44; GND6 18,46.1
U.FL = smd 2.2 x 0.85: 1 0,1.375; 2 0,-1.375 | smd 1.05 x 1: FEED 1.525,0; NC -1.525,0
USB-C-16P-2LAYER-PADS = smd 0.3 x 1: A5 -1.25,-0.34; A6 -0.25,-0.34; A7 0.25,-0.34; A8 1.25,-0.34; B5 1.75,-0.34; B6 0.75,-0.34; B7 -0.75,-0.34; B8 -1.75,-0.34 | smd 0.6 x 1: GND -3.225,-0.34; GND2 3.225,-0.34; VBUS1 -2.45,-0.34; VBUS2 2.45,-0.34 | drill 0.4 pad 0.6 long: SHLD1 -4.318,-0.915; SHLD2 4.318,-0.915; SHLD3 -4.318,-5.095; SHLD4 4.318,-5.095 | hole 0.65: -2.89,-1.445; 2.89,-1.445
NANO_SIM_PP = smd 0.7 x 2.1: A1 6.495,6; A2 -6.495,6; A3 -6.495,-6; A4 6.495,-6 | smd 0.65 x 1.23: C1 0.255,7.535; C2 -2.285,7.535; C3 -4.825,7.535; C5 1.525,7.535; C6 -1.015,7.535; C7 -3.555,7.535; CD 2.475,7.535 | hole 0.75: 3.505,-4.75; -4.995,-4.75
0402_COILCRAFT = smd 0.356 x 0.66: P$1 -0.432,0; P$2 0.432,0
SOT323 = smd 0.7 x 0.7: 1 -0.65,-0.925; 2 0.65,-0.925; 3 0,0.925
TACTILE_SWITCH_SMD_4.6X2.8MM = smd 0.9 x 1: 1 -2.05,-0.8; 2 2.05,-0.8; 3 2.05,0.8; 4 -2.05,0.8
PAD.03X.04 = smd 1.016 x 1.016: 1 0,0
SARA-LGA = smd 0.8 x 1.5: 1 -11,-6.95; 2 -9.9,-6.95; 3 -8.8,-6.95; 4 -7.7,-6.95; 5 -6.6,-6.95; 6 -5.5,-6.95; 7 -4.4,-6.95; 8 -3.3,-6.95; 9 -2.2,-6.95; 10 -1.1,-6.95; 11 0,-6.95; 12 1.1,-6.95; 13 2.2,-6.95; 14 3.3,-6.95; 15 4.4,-6.95; 16 5.5,-6.95; 17 6.6,-6.95; 18 7.7,-6.95; 19 8.8,-6.95; 20 9.9,-6.95; 21 11,-6.95; 33 11,6.95; 34 9.9,6.95; 35 8.8,6.95; 36 7.7,6.95; 37 6.6,6.95; 38 5.5,6.95; 39 4.4,6.95; 40 3.3,6.95; 41 2.2,6.95; 42 1.1,6.95; 43 0,6.95; 44 -1.1,6.95; 45 -2.2,6.95; 46 -3.3,6.95; 47 -4.4,6.95; 48 -5.5,6.95; 49 -6.6,6.95; 50 -7.7,6.95; 51 -8.8,6.95; 52 -9.9,6.95; 53 -11,6.95 | smd 1.5 x 0.8: 22 11.95,-5.5; 23 11.95,-4.4; 24 11.95,-3.3; 25 11.95,-2.2; 26 11.95,-1.1; 27 11.95,0; 28 11.95,1.1; 29 11.95,2.2; 30 11.95,3.3; 31 11.95,4.4; 32 11.95,5.5; 54 -11.95,5.5; 55 -11.95,4.4; 56 -11.95,3.3; 57 -11.95,2.2; 58 -11.95,1.1; 59 -11.95,0; 60 -11.95,-1.1; 61 -11.95,-2.2; 62 -11.95,-3.3; 63 -11.95,-4.4; 64 -11.95,-5.5 | smd 1.1 x 1.1: 65 -10.25,-5.25; 66 -10.25,-3.15; 67 -10.25,-1.05; 68 -10.25,1.05; 69 -10.25,3.15; 70 -10.25,5.25; 71 -8.45,-5.25; 72 -8.45,-3.15; 73 -8.45,-1.05; 74 -8.45,1.05; 75 -8.45,3.15; 76 -8.45,5.25; 77 -6.65,-5.25; 78 -6.65,5.25; 79 -3.05,-5.25; 80 -3.05,5.25; 81 3.05,-5.25; 82 3.05,5.25; 83 6.65,-5.25; 84 6.65,5.25; 85 8.45,-5.25; 86 8.45,-3.15; 87 8.45,-1.05; 88 8.45,1.05; 89 8.45,3.15; 90 8.45,5.25; 91 10.25,-5.25; 92 10.25,-3.15; 93 10.25,-1.05; 94 10.25,1.05; 95 10.25,3.15; 96 10.25,5.25
SOP65P640X120-16N = smd 1.5 x 0.45: 1 -2.9,2.275; 2 -2.9,1.625; 3 -2.9,0.975; 4 -2.9,0.325; 5 -2.9,-0.325; 6 -2.9,-0.975; 7 -2.9,-1.625; 8 -2.9,-2.275; 9 2.9,-2.275; 10 2.9,-1.625; 11 2.9,-0.975; 12 2.9,-0.325; 13 2.9,0.325; 14 2.9,0.975; 15 2.9,1.625; 16 2.9,2.275
SOT23-5 = smd 0.55 x 1.2: 1 -0.95,-1.3; 2 0,-1.3; 3 0.95,-1.3; 4 0.95,1.3; 5 -0.95,1.3
SO08 = smd 0.6 x 1.2: 1 -1.905,-2.8; 2 -0.635,-2.8; 3 0.635,-2.8; 4 1.905,-2.8; 5 1.905,2.8; 6 0.635,2.8; 7 -0.635,2.8; 8 -1.905,2.8
UDFN-8 = smd 0.3 x 0.65: 1 -0.975,-1.375; 2 -0.325,-1.375; 3 0.325,-1.375; 4 0.975,-1.375; 5 0.975,1.375; 6 0.325,1.375; 7 -0.325,1.375; 8 -0.975,1.375 | smd 2.35 x 1.6: EP 0,0
SOT353 = smd 0.42 x 0.7: 1 -0.65,-0.95; 2 0,-0.95; 3 0.65,-0.95; 4 0.65,0.95; 5 -0.65,0.95
SMT-JUMPER_2_NO_SILK = smd 0.635 x 1.27: 1 -0.406,0; 2 0.406,0

### Placement (x,y rotation side)
3V3_LED  11.33,22.1 0 bottom
ANT_REG_EN  8.64,27.94 270 bottom
C1  3.56,30.86 0 top
C2  3.2,32.38 0 top
C3  3.56,35.43 180 top
C4  28.34,57 0 top
C5  33.55,10.77 0 top
C9  16.98,14.73 90 top
C17  30.14,10.77 180 top
C18  34.41,30.53 0 top
C19  34.15,32.24 0 top
C20  34.41,33.84 0 top
C21  3.84,10.16 0 top
C22  34.41,35.49 0 top
C23  5.62,6.99 270 top
C24  34.41,37.14 0 top
C25  3.95,7.25 270 top
C28  13.87,6.03 0 top
C30  13.87,7.62 0 top
C32  13.59,9.21 0 top
C33  33.38,44.87 90 top
C36  19.69,22.82 180 top
C37  17.55,23.5 90 top
C38  20.11,24.26 180 top
C39  19.77,17.76 180 top
C40  19.76,16.27 0 top
D1  7.39,10.41 90 top
D2  7.39,6.35 270 top
D3  11.33,17.27 90 top
D4  6.69,57.72 0 top
D6  14.78,56.02 180 top
D10  31.97,57.85 0 top
D15  19.66,20.33 90 top
D16  1.36,17.27 90 top
D17  4.35,17.27 90 top
D18  8.16,17.27 90 top
F2  25.4,61.59 270 top
FB1  4.08,40.47 90 top
FD1  0.84,4.96 90 top
FD2  2.56,4.81 270 bottom
FD3  36.65,64.17 90 top
FD4  36.65,64.17 270 bottom
FRAME2  3.56,-21.59 0 top  (outside the outline)
I2C  21.49,13.72 0 bottom
J1  18.75,0 0 top
J2  31.39,60.96 270 top
J3  18.7,58.55 180 top
J4  6.1,60.96 270 top
J9  29.97,17.91 90 top
L2  30.98,56.75 0 top
LOGO1  18.38,46.9 0 bottom
LOGO2  29.08,33.02 0 top
LOGO3  50.47,74.42 0 top  (outside the outline)
LOGO4  18.8,26.67 0 top
LOGO6  OSHW-LOGOMINI  [OSHW-LOGO-MINI]  18.29,31.5 0 bottom
LTE_NI  11.81,15.81 180 bottom
LTE_NI_LED  1.42,12.2 270 bottom
LTE_ON  11.81,13.53 180 bottom
LTE_ON_LED  1.44,15.38 270 bottom
LTE_PWR_ON  23.5,7.18 0 bottom
LTE_RESET  11.81,11.24 0 bottom
LTE_RI_LED  23.71,54.97 0 bottom
Q2  27.83,8.96 180 top
Q3  13.36,23.88 0 top
Q5  5.62,22.23 180 top
Q6  8.28,22.23 180 top
R1  22.29,55.21 0 top
R2  6.1,27.94 90 top
R3  33.52,25.26 0 top
R4  11.08,20.7 270 top
R5  12.96,10.92 90 top
R6  19.62,13.06 90 top
R8  21.38,57.85 180 top
R9  17.48,56.98 180 top
R10  20.78,13.08 90 top
R11  18.42,13.07 90 top
R23  28.29,55.69 180 top
R24  3.56,33.91 0 top
R32  27.35,5.53 90 top
R33  10.73,10.85 0 top
R39  28.31,5.54 270 top
R40  27.81,7.12 0 top
R41  12.73,20.7 90 top
R43  1.34,20.82 270 top
R45  4.22,24.45 0 top
R46  4.98,19.81 180 top
R47  5.85,17.87 270 top
R48  8.54,24.45 0 top
R49  8.95,19.65 180 top
R50  9.74,17.83 270 top
S3  24.89,7.6 270 top
TP22  4.83,35.56 0 bottom
U1  18.8,45.72 180 top
U2  33.05,7.39 0 top
U3  3.56,27.94 0 top
U4  19.84,7.75 0 top
U5  10.19,8.26 90 top
U11  13.49,17.4 90 top
U$1  [#I2C#0]  18.29,13.72 0 bottom
U$2  [#ANT_REG_EN#0]  15.24,27.94 0 bottom
U$3  [MICROMOD_MI_LOGO_1]  17.52,42.13 0 bottom
U$4  [#3V3_LED#0]  16.38,22.1 0 bottom
U$5  [ON0]  24.89,4.52 0 top
U$6  [#LTE_ON#2]  3.18,13.53 0 bottom
U$7  [#LTE_NI#2]  3.87,15.81 0 bottom
U$8  [#LTE_PWR_ON#1]  24.45,7.18 0 bottom
U$9  [#NI_LED#0]  1.41,7.95 90 bottom
U$10  [#WP#0]  19.9,8.92 0 bottom
U$11  [LTE_#_GNSS0]  20.07,34.04 0 top
U$12  [MICROMOD_MI_LOGO_1]  9.78,32.92 0 top
U$13  [FUNCTION0]  19.94,31.75 0 top
U$14  [LTE_#_GNSS0]  17.65,38.23 0 bottom
U$15  [U#BLOX_SARA#R510M8S0]  19.43,29.21 0 top
U$16  [LTE0]  35.31,60.96 90 top
U$17  [GNSS0]  2.29,60.96 90 top
U$18  [NANO0]  27.73,24.72 0 top
U$19  [FUNCTION0]  17.65,36.2 0 bottom
U$20  [U#BLOX_SARA#R510M8S0]  17.65,34.04 0 bottom
U$21  [#USB_SHLD#0]  19.29,61.72 0 bottom
U$22  [#LTE_RI_LED#0]  30.02,55 0 bottom
U$23  [#LTE_RST#0]  6.9,11.22 0 bottom
U$24  [#LTE_ON_LED#0]  1.44,22.06 90 bottom
U$29  [NI0]  8.17,15.05 90 top
U$31  [ON0]  4.23,14.8 90 top
U$57  [3V34]  11.34,14.22 90 top
U$80  [RING0]  1.18,14.29 90 top
U$126  [SIM0]  31.04,24.71 0 top
USB_SHLD  13.85,61.71 0 bottom
WP  19.9,7.18 0 bottom

### Tracks (layer width: path | path; a pad name or v marks a point on that pad's centre or on a via)
3.3V  (via drill 0.3 pad 0.61)
  Top 0.254: 9.73,16.39 D3.A 11.69,16.75 U11.5 12.54,17.27 12.73,17.47 v13.39,17.47 | 9.73,16.39 9.46,16.39 8.48,17.37 R47.2 | R50.2 9.67,17.25 9.73,17.2 9.73,16.39 | U2.15 34.05,9.02 33.05,10.02 C5.1 33.29,11.01 v33.29,11.72 | C32.1 13.02,9.28 13.02,9.6
  Top 0.406: U5.1 11.56,7.15 | U4.8 17.93,11.33 17.41,11.85 v17.36,11.85 17.36,13.28 17.65,13.57 | R47.2 | 12.79,10.42 R5.1 | C19.1 33.56,32.33 33.56,33.02 | R11.2 17.65,13.57 | 17.65,13.57 C9.1
  Top 0.762: v14.57,10.96 14.03,10.42 R5.1 13.02,10.36 13.02,9.6 13.02,9.14
  Top 0.813: 11.56,7.15 12.92,7.15 13.02,7.05 C28.1 C30.1 13.02,9.14 | v14.57,11.79 v14.57,10.96 | 29.8,37.14 C24.1 C22.1 C20.1 33.56,33.02 C18.1 v33.56,29.11 v34.36,29.11 | 29.8,37.14 28.7,37.14 | 28.7,37.14 27.85,37.14 27.6,37.39 U1.51 | U1.52 28.7,37.14 | U1.53 29.8,37.14
  Bottom 0.254: I2C.2 21.49,12.53 21.67,12.35 v22.3,12.35 | LTE_ON_LED.2 v2.48,14.86 v2.49,14.86 | LTE_NI_LED.2 v2.55,11.69
  pour Route15 (isolate 0.203, rank 2): -0.25,0 37.75,0 37.75,65 -0.25,65
3.3V_IN  (via drill 0.3 pad 0.61)
  Top 0.254: J1.73 10,2.54 v10.92,3.46 | R33.2 11.23,11.5 11.46,11.74 v11.46,12.39 | R2.2 v6.8,28.44 v6.81,28.43
  Route15 0.254: v10.92,3.46 11.46,4 v11.46,12.39 11.46,19.66 8.52,22.6 8.52,27.82 7.91,28.43 v6.81,28.43
ANT_REG_EN  (via drill 0.3 pad 0.61)
  Top 0.254: U3.3 4.6,26.73 4.99,26.73 5.7,27.44 R2.1 7.17,27.44 v7.25,27.51
  Bottom 0.254: v7.25,27.51 7.25,27.98 7.73,28.46 ANT_REG_EN.1
CTS  (via drill 0.3 pad 0.61)
  Top 0.254: U2.11 35.1,6.42 34.84,6.16 34.84,5.56 34.57,5.29 33.16,5.29 32.81,5.64 v32.81,6.31
  Bottom 0.254: v32.81,6.31 32.28,6.84 26.4,6.84 25.15,5.58 25.15,4.65 23.75,3.25 J1.18
EN  (via drill 0.3 pad 0.61)
  Top 0.254: U5.5 8.81,9.57 9.14,9.9 v9.53,9.9 9.53,10.66 9.72,10.85 R33.1 | v11.84,3.17 11.51,3.17 10.5,2.16 J1.71
  Bottom 0.254: v11.84,3.17 11.84,3.21 11.59,3.45 11.59,7.4 9.53,9.46 v9.53,9.9
EWP  (via drill 0.3 pad 0.61)
  Top 0.254: v18.47,7.17 18.47,8.85 19.2,9.59 U4.7 19.2,10.84 18.42,11.63 R11.1
  Bottom 0.254: J1.40 18.25,4.96 17.42,5.78 17.42,6.62 17.98,7.17 v18.47,7.17 v18.47,7.18 WP.2
GND  (via drill 0.3 pad 0.61)
  Top 0.24: J3.GND2 15.47,58.23 15.36,58.12 14.75,58.12
  Top 0.254: J1.GND4 36.75,40.91 v36.48,40.64 | J1.GND5 34.69,44 34.19,44.49 | J1.GND6 36.73,46.12 36.73,48.01 v36.48,48.26 | J1.GND1 2.05,43.2 J1.GND2 2.05,44.8 J1.GND3 | U5.4 11.54,9.21 10.63,9.21 10.63,9.74 | U1.20 8.9,51.32 U1.91 | U1.21 7.8,51.72 U1.91 | U1.22 7.1,50.97 U1.91 | U1.14 15.75,52.42 U1.81 | U1.1 29.8,51.72 U1.65 30.5,50.97 U1.64 | U1.54 29.3,40.22 U1.70 | U1.50 26.5,39.72 U1.76 | U1.32 7.1,40.47 U1.96 | U1.3 27.6,51.32 U1.71 | C1.2 4.37,30.86 3.47,29.97 | U2.1 30.03,9.78 30.03,10.38 C17.2 | C39.2 19.69,17 21.4,17 | C28.2 14.11,5.42 13.85,5.42 13.5,5.07 | 10.76,6.49 v9.63,6.49 v9.62,6.5 9.62,7.68 10.76,7.68 10.76,6.49
  Bottom 0.254: J1.8 26.25,2.71 v26.56,3.02
  other vias: 28.04,3.04 7.11,58.82 10.66,57.69 6.45,56.13 32.39,59.06 26.84,61.09 5.23,58.51 13.19,58.42 11.12,59.7 16.79,3.05 9.11,4.25 21.66,6.79 29.87,11.94 6.71,14.96 5.97,12.45 3.52,15.05 3.46,12.51 0.68,13.76 0.64,10.18 0.69,7.66 3.46,4.7 6.06,4.7 8.35,12.45 10.43,15.42 14.51,12.76 13.62,15.24 17.08,18.23 15.46,8.89 15.71,6.03 6.82,6.6 17.43,7.87 24.49,12.37 26.32,11.43 28.8,11.51 14.89,19.05 18.7,15.05 16.98,20.32 25.34,28.17 13.74,20.32 29.88,20.6 29.57,18 29.59,15.49 30.84,23.77 5.47,26.42 7.27,26.67 0.98,29.21 0.98,34.29 0.92,37.66 9.81,26.67 12.35,26.67 31.4,33.02 31.4,35.56 30.91,53.2 36.48,50.8 36.48,35.56 36.48,38.1 22.89,50.93 20.79,50.93 0.92,48.26 2.17,51.04 2.3,48.36 2.5,46.29 0.92,50.04 5.09,63.86 3.46,60.96 3.46,62.23 7.29,63.83 8.54,60.96 8.54,62.23 3.46,59.69 0.92,58.42 28.86,60.96 33.94,60.96 30.2,64.07 28.86,62.23 32.62,64.05 33.94,62.23 33.94,59.69 36.48,60.96 11.17,61.69 11.98,63.78 24.22,61.98 30.39,59.08 25.11,64.2 0.92,56.45 36.48,53.34 36.48,55.88 36.48,58.42 4.71,50.95 4.83,52.74 4.73,47 35.14,41.5 35.21,23.39 35.09,18.07 22.21,24.25 28.95,59.52 8.54,59.69 0.92,60.96 0.92,63.5 8.46,57.76 3.46,58.42 2.74,63.84 3.46,56.45 33.71,57.76 34.68,63.95 28.14,63.98 9.66,63.81 17.05,10.86 15.59,4.95 17.1,17.04 6.42,10.21 3.84,10.16 2.63,23.41 6.7,21.02 4.42,21.06 9.93,24.13 24.88,8.72 19.72,18.83 19.7,20.32 23.3,18.79 23.36,10.54 24.87,6.27 27.16,8.96 33.25,26.11 16.69,12.9 28.22,23.3 29.3,22.1 12.47,24.13 12.16,4.82 35.02,15.5 35.33,12.26 34.85,4.6 36.76,10.51 22.57,9.4 17.54,9.42 4.14,27.7 5.49,54.31 4.71,45.05 4.71,42.67 5.1,40.33 5.19,56.66 4.28,54.93 3.54,53.25 3.38,51.03 3.4,49.01 3.39,47.05 3.41,45.08 3.4,42.73 3.05,40.53 0.9,52.11 0.84,54.48 2.29,55.19 2.29,57.38 2.09,53.41 32.08,56.8 33.8,53.67 34.04,51.65 34.05,49.55 34.03,47.61 34.18,45.51 34.17,44.19 33.83,42.97 32.7,41.95 32.57,43.48 32.56,45.43 32.68,47.58 32.68,49.65 32.7,51.61 32.43,53.47 30.46,57.7 34.78,56.7 35.5,54.37 35.38,52.08 35.47,49.75 36.34,47.29 35.21,46.38 34.4,39.67 0.74,40.6 2.27,41.61 0.73,47.38 13.44,32.78 14.39,32.88 12.86,30.81 14.81,26.18 16.86,26.48 25.62,26.01 22.22,27.94 21.68,26.07 20.79,55.87 20.12,55.47 14.28,54.75 17.23,55.12 27.49,3.82 23.53,4.02 33.76,8.28 32.08,6.27 23.5,16.9 23.54,13.74 36.56,32.86 36.56,30.73 36.74,28.12 21.99,48.75 25.31,48.81 16.83,47.71 16.94,43.05 17.46,40.57 23.07,40.09 21.22,42.14 18.15,45.16 19.15,43.33 19.75,40.39 14.51,40.66 14.55,43.94 14.55,47.38 12.82,49.54 12.73,46.12 12.78,42.37 10.06,36.86 6.65,33.74 10.26,31.71 25.13,36.99 21.35,36.94 24.58,31.9 22.12,31.96 18.21,29.96 19.26,27.29 16.87,32.57 9.4,45.75 28.13,45.73 28.13,49.99 9.41,49.94 9.4,41.51 16.04,53.95 23.08,45.55 25.29,44.59 25.18,20.83 25.53,18.02 25.24,15.5 17.97,60.52 13.02,54.74 17.54,57.79 15.84,56.01 12.82,56.83 4.72,48.97 32.48,56.02 31.89,54.52 30.9,56.03 33.37,54.53 26.35,56.3
  pour Top (isolate 0.178, rank 3): 37.75,0 -0.25,0 -0.25,65 37.75,65
  pour Bottom (isolate 0.203, rank 2): -0.25,0 37.75,0 37.75,65 -0.25,65
  pour Bottom (isolate 0.203, rank 2): -0.25,0 37.75,0 37.75,65 -0.25,65
  pour Route2 (isolate 0.203, rank 2): -0.25,0 37.75,0 37.75,65 -0.25,65
GNSS_ANT
  Top 0.312: 4.06,41.34 4.06,52.07 arc-27 4.44,53.66 arc-4 5.86,56.4 arc37 D4.1 6.11,59.42 | U1.31 FB1.2
  Top 0.813: FB1.2 4.06,41.34 | FB1.2 | J4.FEED 6.11,59.42
I2C_SCL
  Top 0.254: J1.21 23,2.32 22.43,2.88 22.43,7.76 20.48,9.72 U4.6 20.46,10.56 20.46,11.27 19.62,12.11 R6.1
I2C_SDA
  Top 0.254: J1.19 23.5,2.47 22.86,3.1 22.86,8.05 21.75,9.18 U4.5 21.75,11.23 20.78,12.19 R10.1
LTE_18_!RESET!  (via drill 0.3 pad 0.61)
  Top 0.254: U1.18 11.1,54.04 v11.2,54.15 | Q3.3 13.36,27.18 12.2,28.35 v12.2,36.19
  Bottom 0.254: v11.2,54.15 11.82,53.53 11.82,36.56 v12.2,36.19
LTE_18_CTS  (via drill 0.3 pad 0.61)
  Top 0.254: v33.12,7.51 32.52,7.51 31.43,6.42 U2.6 | U1.11 18.8,53.63 19.12,53.95 v19.68,53.95
  Route2 0.254: v33.12,7.51 33.12,10.67 34.06,11.62 v34.06,12.31
  Bottom 0.254: v34.06,12.31 33.94,12.43 33.94,24.55 28.89,29.61 28.89,38.36 20.26,46.99 20.26,50.08 19.78,50.56 19.78,53.84 v19.68,53.95
LTE_18_DTR
  Top 0.254: U1.9 21,54.42 R1.1
LTE_18_NI  (via drill 0.3 pad 0.61)
  Top 0.254: U1.16 13.3,53.53 v13.82,54.05 | v11.09,35.47 8.3,32.68 8.3,24.71 R48.1
  Bottom 0.254: v13.82,54.05 13.82,35.89 12.7,34.78 11.78,34.78 v11.09,35.47
LTE_18_PWR_ON  (via drill 0.3 pad 0.61)
  Top 0.254: S3.2 S3.1 24.09,10.34 24.47,10.72 v27.72,10.72 v27.73,10.72 27.81,10.64 27.81,8.06 Q2.3 | U1.15 14.4,53.69 15.37,54.67 v16.57,54.67
  Bottom 0.254: v27.73,10.72 31.16,10.72 31.45,11.01 31.45,21.14 32.08,21.77 32.08,23.45 26.87,28.66 26.87,37.46 18.2,46.14 18.2,49.14 16.66,50.68 16.66,54.58 v16.57,54.67
LTE_18_RI  (via drill 0.3 pad 0.61)
  Top 0.254: U1.7 v23.2,53.9 v23.2,53.91
  Bottom 0.254: LTE_RI_LED.2 23.2,54.95 v23.2,53.91
LTE_18_RTS  (via drill 0.3 pad 0.61)
  Top 0.254: v32.49,8.05 31.51,7.07 U2.5 | U1.10 19.9,53.14 20.35,53.6 20.35,54.22 v19.68,54.9
  Route2 0.254: v33.39,12.71 32.68,11.99 32.68,11.28 32.43,11.04 32.43,8.12 v32.49,8.05
  Bottom 0.254: v19.68,54.9 19.68,54.79 18.98,54.09 18.98,50.58 19.74,49.82 19.74,46.8 28.37,38.17 28.37,29.43 33.49,24.31 33.49,21.06 33.39,20.96 v33.39,12.71
LTE_18_RXO  (via drill 0.3 pad 0.61)
  Top 0.254: U2.4 31.33,7.72 32.24,8.63 32.24,11.22 32.62,11.61 32.62,12.26 v32.15,12.73 | U1.13 16.6,53.18 18.08,54.66 v18.74,54.66
  Bottom 0.254: v18.74,54.66 17.97,54.66 17.39,54.07 17.39,50.69 18.66,49.42 18.66,46.4 27.36,37.7 27.36,28.93 32.54,23.75 32.54,21.58 32.15,21.19 v32.15,12.73
LTE_18_TXI  (via drill 0.3 pad 0.61)
  Top 0.254: U2.3 31.31,8.37 31.86,8.92 31.86,11.67 v32.06,11.88 | U1.12 17.7,53.14 18.18,53.61 v18.18,53.92
  Bottom 0.254: v18.18,53.92 v18.17,53.92 18.17,50.65 19.2,49.61 19.2,46.62 27.86,37.96 27.86,29.22 33.07,24 33.07,21.37 32.77,21.06 32.77,12.57 v32.07,11.88 v32.06,11.88
LTE_!NI!  (via drill 0.3 pad 0.61)
  Top 0.254: Q6.3 9.45,20.13 R49.1 9.45,19.16 9.76,18.85 9.74,18.83 R50.1 9.76,18.33 10.33,17.76 10.33,17.59 v10.65,17.27
  Bottom 0.254: LTE_NI.1 11.29,16.13 10.66,16.76 10.66,17.26 v10.65,17.27
LTE_!ON!  (via drill 0.3 pad 0.61)
  Top 0.254: R46.1 5.88,19.76 v7.05,19.76 | R47.1 5.85,19.8 R46.1 | R46.1 5.83,21.09 Q5.3
  Bottom 0.254: v7.05,19.76 7.05,17.25 10.77,13.53 LTE_ON.1
LTE_!RESET!  (via drill 0.3 pad 0.61)
  Top 0.254: U11.2 14.19,17.4 12.6,15.81 12.6,12.63 12.76,12.47 v12.76,12.41 12.76,11.96 12.77,11.96 12.77,11.61 R5.2
  Bottom 0.254: LTE_RESET.1 12.33,11.53 12.76,11.96 v12.76,12.41
LTE_ANT
  Top 0.312: U1.56 31.85,42.42 arc90 33.37,43.94 C33.1
LTE_PWR_ON  (via drill 0.3 pad 0.61)
  Top 0.254: v25.81,8.08 26.77,7.11 R40.1 27.32,7.1 27.32,7.03 R39.1
  Bottom 0.254: v25.81,8.08 24.91,7.18 LTE_PWR_ON.1
N$1  (via drill 0.3 pad 0.61)
  Top 0.254: U4.1 17.93,5.91 17.98,5.96 v17.98,6.04
  Bottom 0.254: J1.36 19.25,4.93 18.14,6.04 v17.98,6.04
N$2
  Top 0.254: J3.A5 19.95,58.38 20.48,57.85 R8.2
N$3  (via drill 0.3 pad 0.61)
  Top 0.254: J1.57 13.98,1.29 13.98,2.44 13.43,2.98 v13.41,2.98
  Bottom 0.254: LTE_PWR_ON.2 22.98,7.34 21.49,8.83 17.4,8.83 16.32,7.75 16.32,4.13 15.18,2.98 v13.41,2.98
N$4  (via drill 0.3 pad 0.61)
  Top 0.254: v12.74,4.02 12.74,2.71 12.88,2.57 13,2.46 J1.61 | v6.46,26.08 6.46,24.58 v6.37,24.49
  Bottom 0.254: v12.74,4.02 12.74,8.4 10.45,10.69 10.45,13.13 5.73,17.85 5.73,22.52 6.37,23.16 v6.37,24.49 | ANT_REG_EN.2 8.64,26.43 8.28,26.08 v6.46,26.08
N$5
  Top 0.254: J3.B5 16.95,57.02 R9.2
N$6  (via drill 0.3 pad 0.61)
  Top 0.254: R4.1 11.08,23.11 v10.89,23.3
  Bottom 0.254: 3V3_LED.2 10.81,23.36 10.82,23.37 v10.89,23.3
N$7
  Top 0.254: R4.2 11.08,19.42 11.33,19.17 D3.C
N$8  (via drill 0.3 pad 0.61)
  Top 0.254: v20.48,6.03 U4.3
  Bottom 0.254: J1.32 20.25,5.23 20.48,5.46 v20.48,6.03
N$9  (via drill 0.3 pad 0.61)
  Top 0.254: v19.66,6.03 19.55,6.03 19.2,5.68 U4.2
  Bottom 0.254: J1.34 19.75,5.93 v19.66,6.03
N$10  (via drill 0.3 pad 0.61)
  Top 0.24: D6.1 15.53,55.52 15.59,55.46 16.06,55.46 16.45,55.85 18.48,55.85 19.19,56.56 19.19,57.85 18.95,58.1 J3.A6 18.95,59.77 v18.97,59.79 | J3.B6 17.95,59.39 17.94,59.4 17.94,59.6 v17.75,59.79
  Bottom 0.24: v18.97,59.79 v17.75,59.79
N$11
  Top 0.312: C33.2 33.38,52.15 arc31 32.8,54.23 arc12 31.66,56.01 arc-39 L2.P$2 31.4,57.84 D10.1 J2.FEED
N$12  (via drill 0.3 pad 0.61)
  Top 0.254: J1.47 16.49,1.28 16.49,2.55 14.83,4.2 v14.83,4.76
  Bottom 0.254: LTE_NI.2 12.33,15.37 13.79,13.91 13.79,9.58 14.56,8.81 14.56,5.54 14.83,5.27 v14.83,4.76
N$13  (via drill 0.3 pad 0.61)
  Top 0.254: R10.2 20.78,14.8 v20.63,14.95
  Bottom 0.254: v20.63,14.95 22.06,14.95 22.53,14.48 I2C.1
N$14  (via drill 0.3 pad 0.61)
  Top 0.254: R6.2 19.62,14.75 v19.82,14.95
  Bottom 0.254: I2C.3 19.99,13.72 19.82,13.89 v19.82,14.95
N$15
  Top 0.24: J3.B7 19.45,59.43 19.59,59.57 19.59,60.02 19.21,60.41 18.72,60.41 18.36,60.04 18.36,59.57 18.45,59.48 J3.A7 18.5,58.84 18.5,57.95 18.77,57.68 18.77,56.73 18.31,56.27 16.44,56.27 16.09,56.62 15.61,56.62 15.52,56.52 D6.3
N$16  (via drill 0.3 pad 0.61)
  Top 0.254: J1.49 15.99,1.28 15.99,2.45 14.09,4.35 v14.09,4.85
  Bottom 0.254: v14.09,4.85 14.09,8.64 13.35,9.38 13.35,13.07 12.89,13.53 LTE_ON.2
N$17  (via drill 0.3 pad 0.61)
  Top 0.254: J1.51 15.5,2.33 13.54,4.29 v13.52,4.29
  Bottom 0.254: LTE_RESET.2 11.29,10.86 13.52,8.63 v13.52,4.29
N$18
  Top 0.254: R23.2 27.79,56.26 | 27.79,56.26 27.79,56.97 C4.1 | L2.P$1 30.15,56.75 29.66,56.26 27.79,56.26
N$19  (via drill 0.3 pad 0.61)
  Top 0.254: v2.47,12.72 3.4,13.66 4.02,13.66 6.75,16.39 D18.A
  Bottom 0.254: LTE_NI_LED.1 v2.47,12.72
N$20  (via drill 0.3 pad 0.61)
  Top 0.254: R43.1 1.34,23.14 2.57,24.36 v2.57,24.46 | v24,35.66 25.85,35.66 27.09,34.41 v29.72,34.41
  Bottom 0.254: v2.57,24.46 2.13,24.9 2.13,27.04 4.17,29.09 15,29.09 21.57,35.66 v24,35.66 | v29.72,34.41 29.4,34.73 29.4,38.55 24.23,43.72 LTE_RI_LED.1
N$21  (via drill 0.3 pad 0.61)
  Top 0.254: v2.48,15.9 2.98,16.39 D17.A
  Bottom 0.254: LTE_ON_LED.1 v2.48,15.9
N$22  (via drill 0.3 pad 0.61)
  Top 0.762: v25.4,61.45 F2.1
  Bottom 0.762: v20.17,61.33 20.2,61.33 v20.2,60.67 20.2,59.39 21.83,57.76 24.23,57.76 24.82,58.35 24.82,60.88 v25.4,61.45 25.37,61.48 v25.37,62.19
  pour Top (no thermals): 15.98,58.42 16.52,58.42 16.52,59.65 17.74,60.88 19.29,60.88 20.86,59.31 20.86,58.42 21.43,58.42 21.43,60.69 20.46,61.66 17.05,61.66 15.98,60.59
N$24
  Top 0.254: R24.1 C2.1 C1.1
  Top 0.305: U3.5 2.61,30.76 C1.1
N$25  (via drill 0.3 pad 0.61)
  Top 0.254: C3.1 v4.41,36.62 v4.42,36.63
  Top 0.305: R24.2 C3.1 | FB1.1 4.08,36.95 v4.41,36.62
  Bottom 0.254: TP22.1 4.83,35.69 4.42,36.1 v4.42,36.63
N$26
  Top 0.254: Q2.1 28.48,7.29 R40.2
N$27
  Top 0.254: R41.2 12.73,22.94 Q3.1
N$28
  Top 0.254: U11.4 12.54,19.22 12.73,19.41 R41.1
N$34
  Top 0.254: R43.2 1.34,18.17 D16.C
N$35
  Top 0.254: Q6.1 8.93,24.34 R48.2
N$37
  Top 0.254: R49.2 8.45,19.1 8.16,18.81 D18.C
N$47
  Top 0.254: Q5.1 6.14,23.15 4.85,24.45 R45.2
N$49
  Top 0.254: D17.C 4.35,19.6 R46.2
RTS  (via drill 0.3 pad 0.61)
  Top 0.254: U2.12 35.13,7.07 34.48,6.42 34.48,6.08 34.28,5.88 v33.39,5.88 v33.38,5.87 | R32.2 26.9,6.03 26.68,6.25 v26.62,6.25
  Bottom 0.254: v33.38,5.87 33.23,5.72 31.18,5.72 30.66,6.25 v26.62,6.25 25.82,5.45 25.82,4.59 24.25,3.02 J1.16
RX  (via drill 0.3 pad 0.61)
  Top 0.254: v34.41,7.92 34.59,7.92 35.04,8.37 U2.14 | J1.15 24.5,2.84 25.48,3.82 v26.61,3.82
  Bottom 0.254: v26.61,3.82 27.68,4.89 34.23,4.89 34.78,5.44 34.78,7.55 v34.41,7.92
SARA_ANT_DET
  Top 0.254: U1.62 31.68,49.02 31.91,49.25 31.91,52.35 31.57,52.7 31.57,53.71 30.7,54.58 30.3,54.58 29.19,55.69 R23.1
SHLD  (via drill 0.3 pad 0.61)
  Top 0.24: J3.SHLD1 23.02,61.3 22.91,61.4 | J3.SHLD3 23.02,62.31 22.84,62.14 | J3.SHLD2 14.38,61.18 | J3.SHLD4 14.38,62.14
  other vias: 21.34,63.5
  pour Top (isolate 0.305, rank 2): 14.22,64.26 14.22,60.32 23.21,60.32 23.21,64.26
  pour Bottom (isolate 0.305): 14.22,64.26 14.22,60.42 23.11,60.42 23.11,64.26
SIM_CLK
  Top 0.254: D15.1 20.85,19.35 20.62,19.12 C39.1 21.51,17.76 21.73,17.54 23.59,17.54 23.98,17.93 | J9.C3 23.86,13.08 24.63,13.86 24.63,16.05 24.8,16.21 24.8,17.11 23.98,17.93 | U1.38 13.3,37.48 21.31,29.47 25.61,29.47 26.72,28.36 26.72,22.73 26.16,22.18 24.7,22.18 23.98,21.46 23.98,17.93
  pour Top (isolate 0.076): 23.59,17.54 24.37,17.54 23.98,17.93
SIM_DET  (via drill 0.3 pad 0.61)
  Top 0.254: v29.07,21.15 29.48,21.15 29.48,21.17 31.54,23.22 31.54,25.26 | v23.22,22.22 22.69,21.69 22.69,20.64 J9.CD | 31.54,25.26 31.54,28.29 25.25,34.57 20.96,34.57 17.7,37.84 U1.42 | R3.1 31.54,25.26
  Bottom 0.254: v29.07,21.15 28.96,21.04 26.9,21.04 25.72,22.22 v23.22,22.22
SIM_IO  (via drill 0.3 pad 0.61)
  Top 0.254: v17.45,19.38 D15.6 | v24,16.31 24.17,16.15 24.17,15.16 23.36,14.35 J9.C7 21.62,14.35 21.45,14.52 21.45,15.47 20.66,16.27 C40.2 | U1.39 14.4,37.06 21.5,29.95 25.81,29.95 27.1,28.66 27.1,22.31 26.3,21.52 24.77,21.52 24.41,21.16 24.41,18.36 v24.72,18.05
  Bottom 0.254: v17.45,19.38 v17.45,19.39 19.3,17.53 22.78,17.53 23.29,18.05 v24.72,18.05 24.72,17.04 v24,16.31
SIM_RST  (via drill 0.3 pad 0.61)
  Top 0.254: D15.4 18.46,21.33 v17.36,21.33 17.36,21.66 17.55,21.86 C37.1 | v27.68,22.65 27.48,22.86 27.48,28.88 25.95,30.41 21.68,30.41 15.5,36.59 U1.40 | v23.61,15.67 22.49,15.67 J9.C2
  Bottom 0.254: v27.68,22.65 26.81,23.52 22.61,23.52 | v23.61,15.67 24.4,14.88 25.68,14.88 26.15,15.36 26.15,18.32 23.55,20.93 23.54,20.93 22.61,21.86 22.61,23.52 | v17.36,21.33 19.56,23.53 22.61,23.53 22.61,23.52
TX  (via drill 0.3 pad 0.61)
  Top 0.254: U2.13 35.11,7.72 33.95,6.55 v33.95,6.44 | v25.72,3.06 25,2.34 J1.13
  Bottom 0.254: v33.95,6.44 33.95,5.54 33.71,5.31 27.27,5.31 25.72,3.75 v25.72,3.06
USB_N  (via drill 0.3 pad 0.61)
  Top 0.24: J1.37 19,2.67 18.8,2.88 17.86,2.88 16.35,4.39 16.35,9.94 15.78,10.51 15.78,12.27 15.14,12.91 15.14,15.75 15.66,16.27 15.66,29.5 13.81,31.35 v13.5,31.35 | U1.28 5.7,44.62 | D6.4 13.73,56.52 v13.62,56.64
  Top 0.254: 5.7,44.62 v5.68,44.63
  Bottom 0.24: v13.5,31.35 13.27,31.58 12.27,31.58 5.79,38.07 5.79,42.54 5.07,43.25 5.07,43.78 5.68,44.39 v5.68,44.63 5.68,52.22 9.68,56.22 13.2,56.22 v13.62,56.64
USB_P  (via drill 0.3 pad 0.61)
  Top 0.24: J1.35 19.5,2.77 18.97,3.3 18.04,3.3 16.77,4.57 16.77,10.11 16.2,10.68 16.2,12.45 15.56,13.08 15.56,15.57 16.08,16.1 16.08,29.67 13.8,31.95 v13.8,32.08 | U1.29 v5.69,43.52 | v13.6,55.41 13.71,55.52 D6.6
  Top 0.254: v5.69,43.52 v5.68,43.52
  Bottom 0.24: v13.8,32.08 13.73,32.01 12.44,32.01 6.22,38.22 6.22,42.71 5.68,43.25 v5.68,43.52 5.68,43.78 6.29,44.39 6.29,44.9 6.1,45.08 6.1,52.04 9.85,55.79 13.22,55.79 v13.6,55.41
V_USB  (via drill 0.3 pad 0.61)
  Top 0.24: D6.5 13.25,56.02
  Top 0.254: 12.08,55.87 12.2,55.87 13.1,55.87 13.25,56.02
  Top 0.559: 12.08,55.87 12.08,57.11 12.5,57.53 15.53,57.53 v15.84,57.22 | 12.2,55.87 U1.17
  Top 0.762: v26.3,58.43 26.29,58.45 v26.29,59.15 26.29,60.09 F2.2
  Top 0.813: D1.A v7.39,12.51 v6.89,13.02
  Bottom 0.559: 15.18,54.37 16.82,56.02 | v15.84,57.22 17.04,56.02 17.53,56.02
  Bottom 0.762: v6.89,13.02 6.89,13.43 1.38,18.94 1.38,27.83 3.51,29.96 14.07,29.96 15.58,31.47 15.58,49.82 15.18,50.23 15.18,54.37 | 16.82,56.02 17.53,56.02 19.42,56.02 20.25,56.85 25.14,56.85 26.3,58.01 v26.3,58.43
  Bottom 0.813: v6.89,13.02 v7.39,12.51
  pour Bottom (isolate 0.305): 26.57,58.42 26.57,59.5 26,59.5 26,58.42
VCC  (via drill 0.3 pad 0.61)
  Top 0.762: D2.A v8.79,5.2 9.36,5.2 9.36,5.21 v9.55,5.21
  Bottom 0.127: J1.74 9.91,1.52 10,1.52 J1.72
  Bottom 0.762: v8.79,5.2 9.55,5.2 v9.55,5.21 9.68,5.21 10,4.89 10,1.52
  pour Bottom (isolate 0.127, no thermals): 10.36,0.6 10.36,2.47 9.63,2.47 9.63,0.6
VCCIO  (via drill 0.3 pad 0.61)
  Top 0.254: U2.2 29.23,9.02 29.03,8.82 29.03,5.28 29.13,5.18 29.2,5.12 U2.8
  Top 0.406: U2.2 31.04,9.02 v31.31,9.29 31.31,10.19 30.72,10.77 C17.1 30.64,11.76 v30.72,11.83 | v34.77,9.65 34.78,9.66 U2.16 | v3.68,25.29 3.72,25.25 R45.1 3.72,22.92 2.71,21.91 2.71,17.71 1.38,16.38 D16.A | v33.25,27.61 34.02,26.84 R3.2 34.02,24.38 31.86,22.22 v31.35,22.22 | v26.53,53.95 26.53,52.71 U1.4
  Bottom 0.406: v3.68,25.29 3.74,25.35 7.31,25.35 8.72,23.94 8.72,22 11.13,19.59 12.95,19.59 16.46,16.08 22.32,16.08 25.34,13.06 30.73,13.06 | v34.77,9.65 34.76,9.66 31.69,9.66 v31.31,9.29 | v33.25,27.61 v33.26,27.61 32.21,28.66 32.21,38.13 26.53,43.8 v26.53,53.95 | 30.73,13.06 30.73,21.6 v31.35,22.22 | v30.72,11.83 30.73,11.85 30.73,13.06
VIN  (via drill 0.3 pad 0.61)
  Top 0.254: U3.1 2.61,25.54 v2.85,25.3
  Top 0.406: C23.1 5.24,8.21 | 7.06,7.83 D2.C | U5.8 8.81,7.06
  Top 0.813: 5.24,8.21 C21.+ | 7.06,7.83 C23.1 4.04,7.83 C25.1 | 8.81,7.06 7.84,7.06 D2.C D1.C 7.39,9.95 9.18,11.73 v9.44,11.98
  Bottom 0.254: v2.85,25.3 3.21,24.93 3.21,19.51 9.44,13.29 v9.44,11.98
VSIM  (via drill 0.3 pad 0.61)
  Top 0.406: v27.78,21.72 27.84,21.78 27.84,21.82 29.64,23.61 29.64,28.61 24.99,33.26 20.63,33.26 16.6,37.29 U1.41 | v25.97,22.93 22.95,22.93 22.05,22.04 v22.05,21.27 D15.3 20.19,21.28 19.19,22.29 C36.2 19.19,24.19 C38.2 | J9.C1 21.93,18.16 v21.42,18.67
  Bottom 0.406: v27.78,21.72 27.71,21.65 27.24,21.65 v25.97,22.93 | v22.05,21.27 22.05,19.3 v21.42,18.67

### Text on the board
Top: 1
Route2: 2
Route15: 3
Bottom: v11 | 4
Measures: Measurement Units: MM
tDocu: Thickness: 0.8mm PCB / ENIG Finish / 45 degree chamfered edge / 4-layer Board / Soldermask Color: red / Material: TG155 / Stackup: JLC7628 | Michael Ammann | Revised by: Pete Lewis